# EAGLE design Cosmic Pi Main Board V2.4 OHWR (EAGLE 8.3.1)
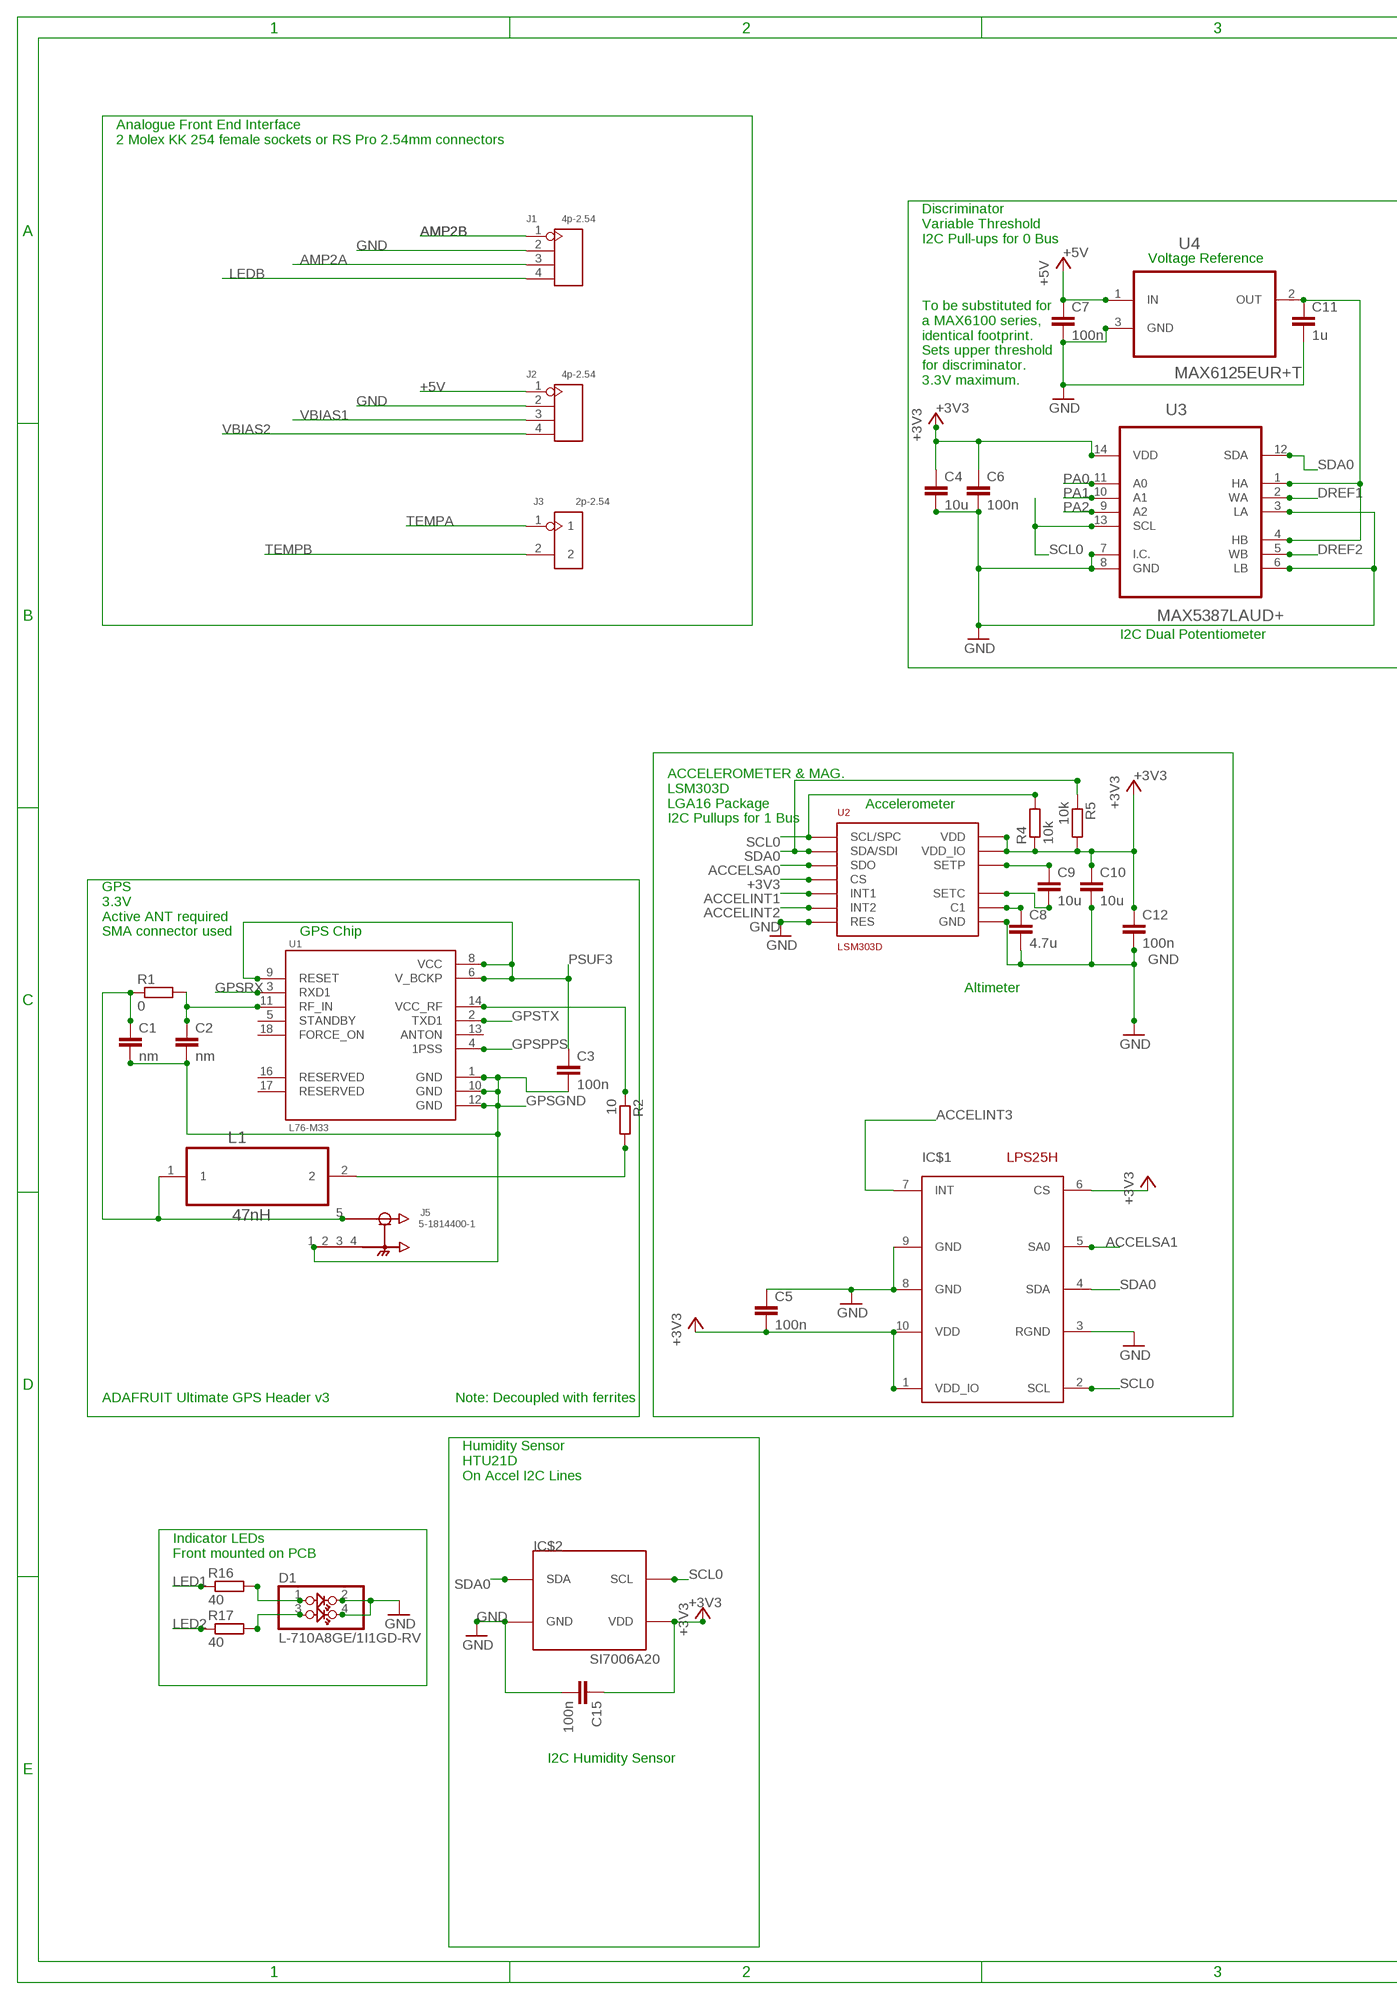
[diagram p0: schematic, sheet 1, part 1 of 2]
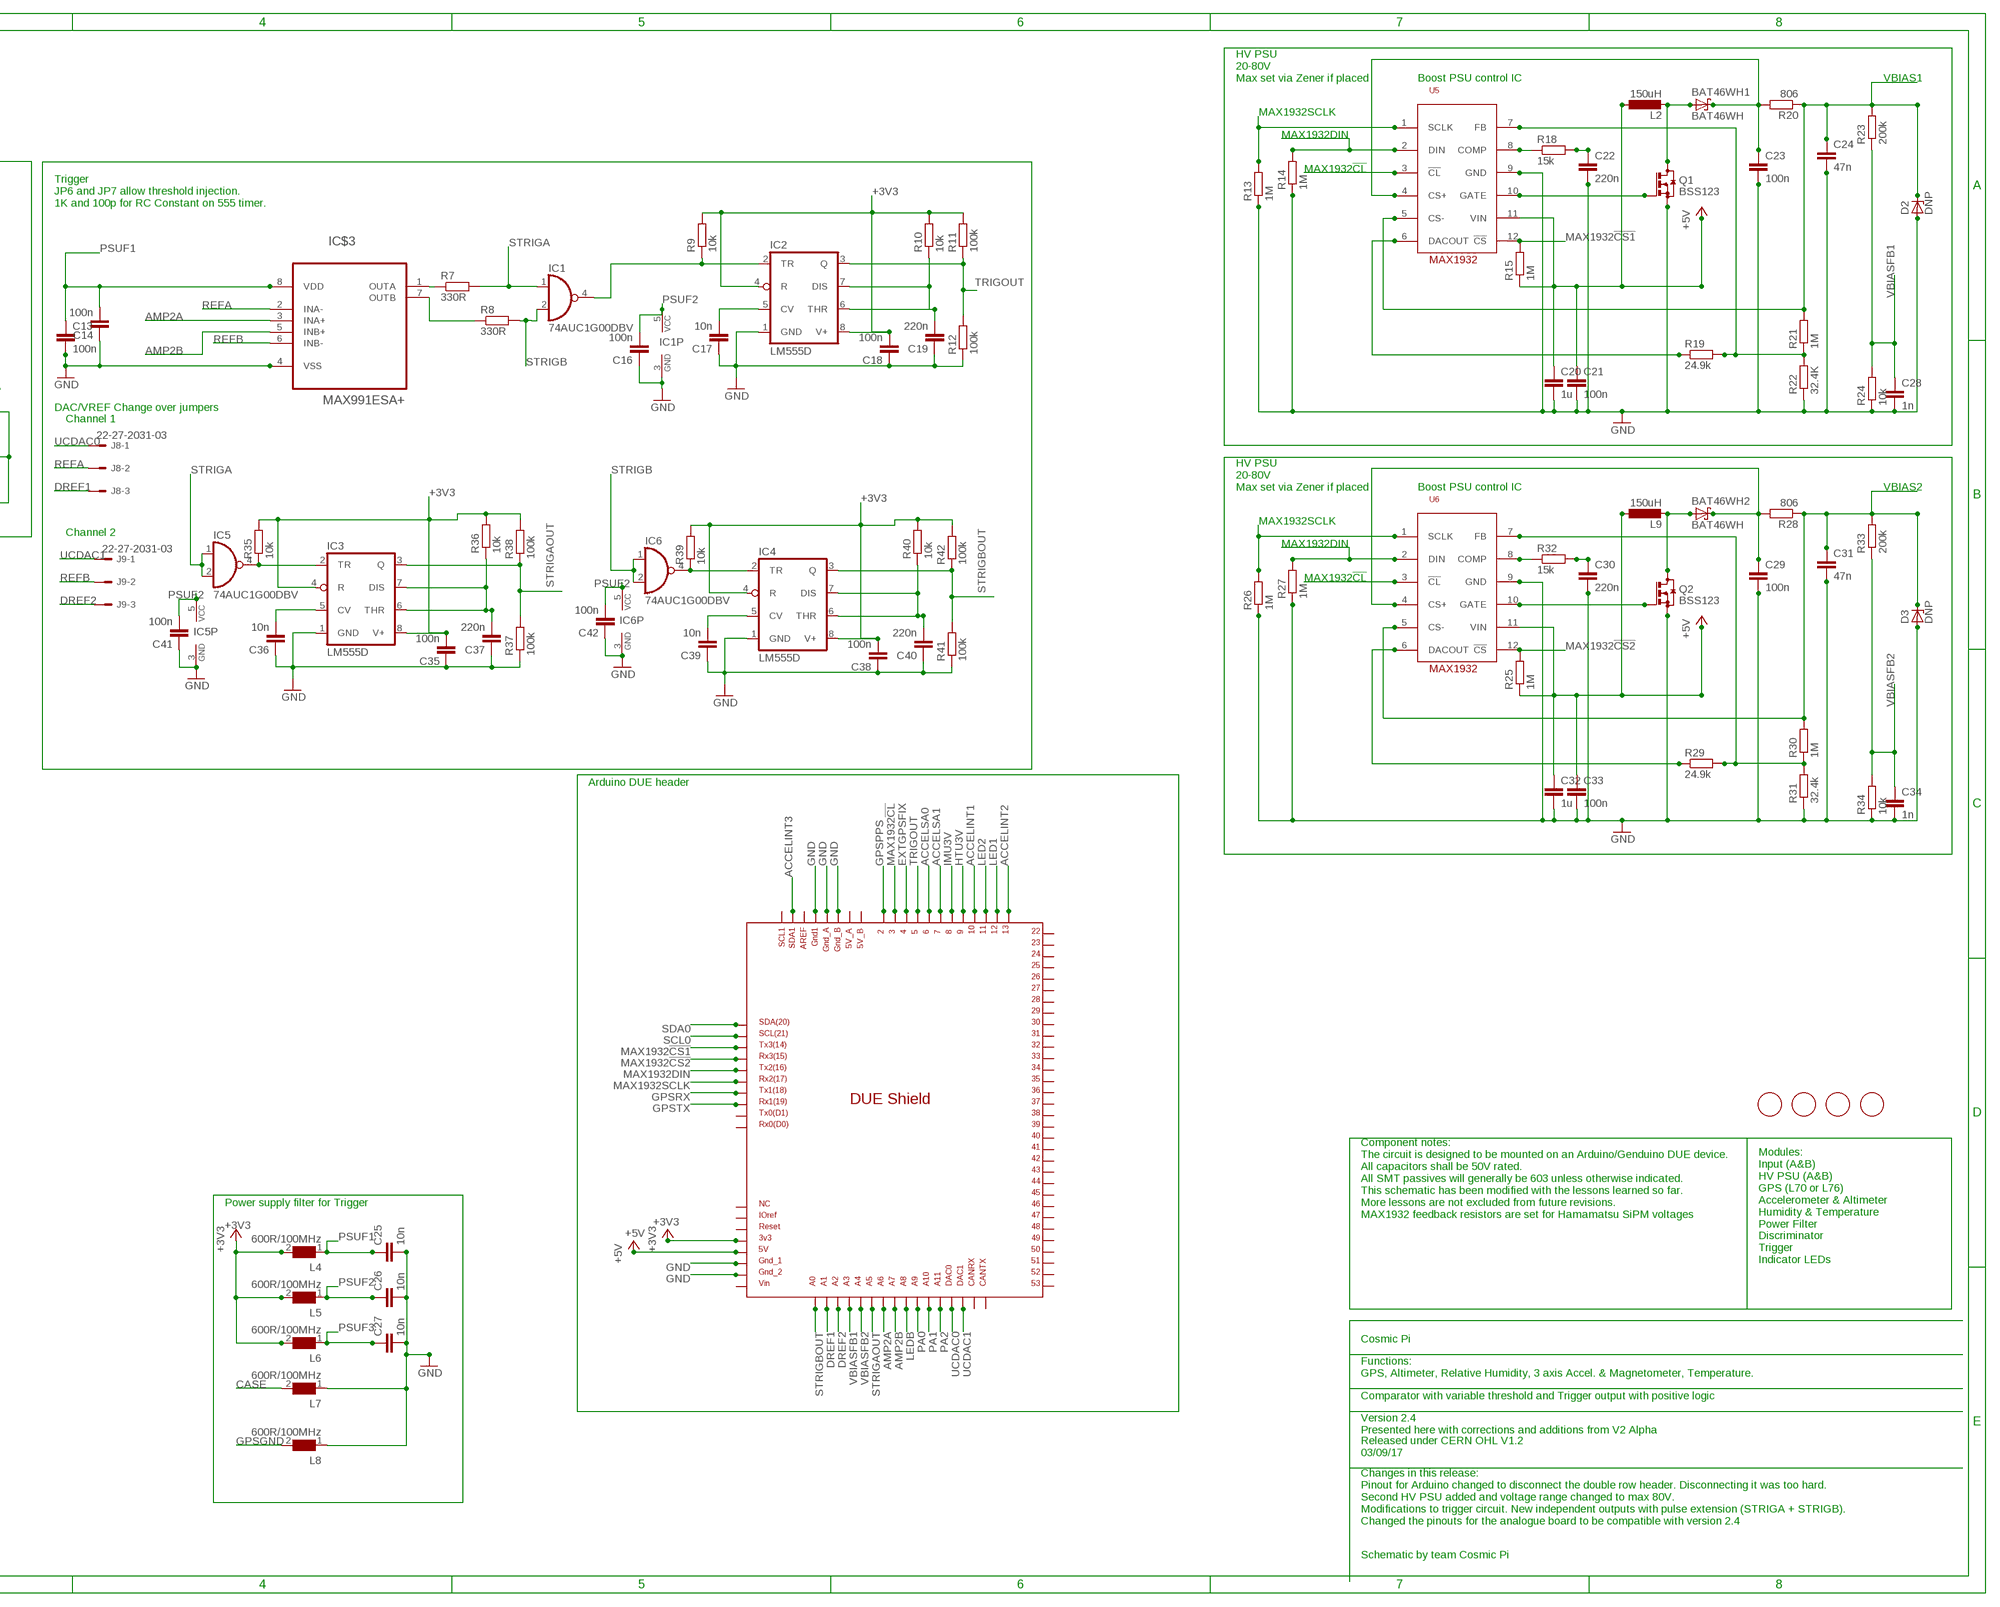
[diagram p1: schematic, sheet 1, part 2 of 2]

## Parts
BAT46WH1  BAT46WH  [SOD123F]
BAT46WH2  BAT46WH  [SOD123F]
C1  nm  C-EUC0603  [C0603]
C2  nm  C-EUC0603  [C0603]
C3  100n  C-EUC0603  [C0603]
C4  10u  C-EUC0603  [C0603]
C5  100n  C-EUC0603  [C0603]
C6  100n  C-EUC0603  [C0603]
C7  100n  C-EUC0603  [C0603]
C8  4.7u  C-EUC0603  [C0603]
C9  10u  C-EUC0603  [C0603]
C10  10u  C-EUC0603  [C0603]
C11  1u  C-EUC0603  [C0603]
C12  100n  C-EUC0603  [C0603]
C13  100n  C-EUC0603  [C0603]
C14  100n  C-EUC0603  [C0603]
C15  100n  C-EUC0603  [C0603]
C16  100n  C-EUC0603  [C0603]
C17  10n  C-EUC0603  [C0603]
C18  100n  C-EUC0603  [C0603]
C19  220n  C-EUC0603  [C0603]
C20  1u  C-EUC0603  [C0603]
C21  100n  C-EUC0603  [C0603]
C22  220n  C-EUC0603  [C0603]
C23  100n  C-EUC0603  [C0603]
C24  47n  C-EUC0603  [C0603]
C25  10n  C-EUC0603  [C0603]
C26  10n  C-EUC0603  [C0603]
C27  10n  C-EUC0603  [C0603]
C28  1n  C-EUC0603  [C0603]
C29  100n  C-EUC0603  [C0603]
C30  220n  C-EUC0603  [C0603]
C31  47n  C-EUC0603  [C0603]
C32  1u  C-EUC0603  [C0603]
C33  100n  C-EUC0603  [C0603]
C34  1n  C-EUC0603  [C0603]
C35  100n  C-EUC0603  [C0603]
C36  10n  C-EUC0603  [C0603]
C37  220n  C-EUC0603  [C0603]
C38  100n  C-EUC0603  [C0603]
C39  10n  C-EUC0603  [C0603]
C40  220n  C-EUC0603  [C0603]
C41  100n  C-EUC0603  [C0603]
C42  100n  C-EUC0603  [C0603]
D1  L-710A8GE/1I1GD-RV  KINGBRITET1  [2X02]
D2  DNP  ZENER-DIODESOT23  [SOT23]
D3  DNP  ZENER-DIODESOT23  [SOT23]
DUE1  DUE(NORMAL)  [DUE(NORMAL)]
IC1  74AUC1G00DBV  [SOT23-5]
IC2  LM555D  [SO08]
IC3  LM555D  [SO08]
IC4  LM555D  [SO08]
IC5  74AUC1G00DBV  [SOT23-5]
IC6  74AUC1G00DBV  [SOT23-5]
IC$1  LPS25H  [LPS25H]
IC$2  SI7006A20  [3X3DFN]
IC$3  MAX991ESA+  [SOIC-8]
J1  4p-2.54  DIP-BLACK-FEMALE-HEADER-VERT(4P-2.54)  [H4-2.54]
J2  4p-2.54  DIP-BLACK-FEMALE-HEADER-VERT(4P-2.54)  [H4-2.54]
J3  2p-2.54  DIP-BLACK-MALE-HEADER-VERT(2P-2.54)  [H2-2.54]
J5  5-1814400-1  [TE_5-1814400-1]
J8  22-27-2031-03  [6410-03]
J9  22-27-2031-03  [6410-03]
L1  47nH  B82496C3470J  [INDC1608X90N]
L2  150uH  L-EUL1812  [L1812]
L4  600R/100MHz  WE-CBF-74279218_1206  [1206]
L5  600R/100MHz  WE-CBF-74279218_1206  [1206]
L6  600R/100MHz  WE-CBF-74279218_1206  [1206]
L7  600R/100MHz  WE-CBF-74279218_1206  [1206]
L8  600R/100MHz  WE-CBF-74279218_1206  [1206]
L9  150uH  L-EUL1812  [L1812]
Q1  BSS123  [SOT23]
Q2  BSS123  [SOT23]
R1  0  R-EU_R0603  [R0603]
R2  10  R-EU_R0603  [R0603]
R4  10k  R-EU_R0603  [R0603]
R5  10k  R-EU_R0603  [R0603]
R7  330R  R-EU_R0603  [R0603]
R8  330R  R-EU_R0603  [R0603]
R9  10k  R-EU_R0603  [R0603]
R10  10k  R-EU_R0603  [R0603]
R11  100k  R-EU_R0603  [R0603]
R12  100k  R-EU_R0603  [R0603]
R13  1M  R-EU_R0603  [R0603]
R14  1M  R-EU_R0603  [R0603]
R15  1M  R-EU_R0603  [R0603]
R16  40  R-EU_R0603  [R0603]
R17  40  R-EU_R0603  [R0603]
R18  15k  R-EU_R0603  [R0603]
R19  24.9k  R-EU_R0603  [R0603]
R20  806  R-EU_R0603  [R0603]
R21  1M  R-EU_R0603  [R0603]
R22  32.4K  R-EU_R0603  [R0603]
R23  200k  R-EU_R0603  [R0603]
R24  10k  R-EU_R0603  [R0603]
R25  1M  R-EU_R0603  [R0603]
R26  1M  R-EU_R0603  [R0603]
R27  1M  R-EU_R0603  [R0603]
R28  806  R-EU_R0603  [R0603]
R29  24.9k  R-EU_R0603  [R0603]
R30  1M  R-EU_R0603  [R0603]
R31  32.4k  R-EU_R0603  [R0603]
R32  15k  R-EU_R0603  [R0603]
R33  200k  R-EU_R0603  [R0603]
R34  10k  R-EU_R0603  [R0603]
R35  10k  R-EU_R0603  [R0603]
R36  10k  R-EU_R0603  [R0603]
R37  100k  R-EU_R0603  [R0603]
R38  100k  R-EU_R0603  [R0603]
R39  10k  R-EU_R0603  [R0603]
R40  10k  R-EU_R0603  [R0603]
R41  100k  R-EU_R0603  [R0603]
R42  100k  R-EU_R0603  [R0603]
U1  L76-M33  [CAPCAV110P970X1010X250-18N]
U2  LSM303D  [LGA16L]
U3  MAX5387LAUD+  [TSSOP-14]
U4  MAX6125EUR+T  [SOT95P237X112-3N]
U5  MAX1932  [TQFN-12]
U6  MAX1932  [TQFN-12]
U$1  FIDUCIAL  [FIDUCIAL_1MM]
U$2  FIDUCIAL  [FIDUCIAL_1MM]
U$3  FIDUCIAL  [FIDUCIAL_1MM]
U$4  FIDUCIAL  [FIDUCIAL_1MM]

## Nets
+3V3 [Peripheral]: C4.1 C5.2 C6.1 C10.1 C12.1 C15.1 C18.2 C35.2 C38.2 DUE1.3V3 IC2.4(R) IC2.8(V+) IC3.4(R) IC3.8(V+) IC4.4(R) IC4.8(V+) IC$1.1(VDD_IO) IC$1.6(CS) IC$1.10(VDD) IC$2.P$5(VDD) L4.2 L5.2 L6.2 R4.1 R5.2 R9.2 R10.2 R11.2 R35.2 R36.2 R38.2 R39.2 R40.2 R42.2 U2.P$1(VDD_IO) U2.P$8(CS) U2.P$14(VDD) U3.14(VDD)
+5V [PSU]: C7.1 C20.1 C21.1 C32.1 C33.1 DUE1.5V J2.1 L2.1 L9.1 R15.1 R25.1 U4.1(IN) U5.11(VIN) U6.11(VIN)
ACCELINT1 [Peripheral]: DUE1.10 U2.P$11(INT1)
ACCELINT2 [Peripheral]: DUE1.13 U2.P$9(INT2)
ACCELINT3 [Peripheral]: DUE1.SDA1 IC$1.7(INT)
ACCELSA0 [Peripheral]: DUE1.6 U2.P$7(SDO)
ACCELSA1 [Peripheral]: DUE1.7 IC$1.5(SA0)
AMP2A [timing]: DUE1.A6 IC$3.3(INA+) J1.3
AMP2B [timing]: DUE1.A7 IC$3.5(INB+) J1.1
CASE [gnd]: L7.2
DREF1 [Peripheral]: DUE1.A1 J8.3 U3.2(WA)
DREF2 [Peripheral]: DUE1.A2 J9.3 U3.5(WB)
EXTGPSFIX [Peripheral]: DUE1.4
GND: C4.2 C5.1 C6.2 C7.2 C8.2 C10.2 C11.2 C12.2 C13.2 C14.1 C15.2 C16.1 C17.1 C18.1 C19.1 C20.2 C21.2 C22.2 C23.2 C24.2 C25.2 C26.2 C27.2 C28.2 C29.2 C30.2 C31.2 C32.2 C33.2 C34.2 C35.1 C36.1 C37.1 C38.1 C39.1 C40.1 C41.1 C42.1 D1.2 D1.4 D2.1(A) D3.1(A) DUE1.GND1 DUE1.GND_1 DUE1.GND_2 DUE1.GND_A DUE1.GND_B IC1.3(GND) IC2.1(GND) IC3.1(GND) IC4.1(GND) IC5.3(GND) IC6.3(GND) IC$1.3(RGND) IC$1.8(GND) IC$1.9(GND) IC$2.P$2(GND) IC$3.4(VSS) J1.2 J2.2 L7.1 L8.1 Q1.2(S) Q2.2(S) R12.1 R13.1 R14.1 R22.1 R24.1 R26.1 R27.1 R31.1 R34.1 R37.1 R41.1 U2.P$5(GND) U2.P$10(RES) U2.P$12(GND) U2.P$13(GND) U2.P$16(GND) U3.3(LA) U3.6(LB) U3.7(I.C.) U3.8(GND) U4.3(GND) U5.9(GND) U6.9(GND)
GPSGND [timing]: C1.2 C2.2 C3.2 J5.1(GND) L8.2 U1.1(GND) U1.10(GND) U1.12(GND)
GPSPPS [timing]: DUE1.2 U1.4(1PSS)
GPSRX [Comms]: DUE1.TX1 U1.3(RXD1)
GPSTX [Comms]: DUE1.RX1 U1.2(TXD1)
HTU3V [Peripheral]: DUE1.9
IMU3V [Peripheral]: DUE1.8
LED1: DUE1.12 R16.1
LED2: DUE1.11 R17.1
LEDB: DUE1.A8 J1.4
MAX1932!CL: DUE1.3 U5.3(!CL) U6.3(!CL)
MAX1932!CS1: DUE1.TX3 R15.2 U5.12(!CS)
MAX1932!CS2: DUE1.RX3 R25.2 U6.12(!CS)
MAX1932DIN: DUE1.TX2 R14.2 R27.2 U5.2(DIN) U6.2(DIN)
MAX1932SCLK: DUE1.RX2 R13.2 R26.2 U5.1(SCLK) U6.1(SCLK)
N$2: IC$3.1(OUTA) R7.1
N$4: IC$3.7(OUTB) R8.1
N$5 [Peripheral]: C17.2 IC2.5(CV)
N$6 [Peripheral]: C19.2 IC2.6(THR) IC2.7(DIS) R10.1
N$7 [Peripheral]: C36.2 IC3.5(CV)
N$8: Q2.1(G) U6.10(GATE)
N$9 [Vbias]: BAT46WH2.2(A) L9.2 Q2.3(D)
N$10 [Vbias]: BAT46WH2.1(K) C29.1 R28.2 U6.4(CS+)
N$11: R29.1 U6.6(DACOUT)
N$12: R32.1 U6.8(COMP)
N$13: C30.1 R32.2
N$14: R29.2 R30.1 R31.2 U6.7(FB)
N$17 [Peripheral]: C37.2 IC3.6(THR) IC3.7(DIS) R36.1
N$18: IC1.4(O) IC2.2(TR) R9.1
N$19: Q1.1(G) U5.10(GATE)
N$21 [Peripheral]: C39.2 IC4.5(CV)
N$22 [Peripheral]: C40.2 IC4.6(THR) IC4.7(DIS) R40.1
N$24: IC4.2(TR) IC6.4(O) R39.1
N$25: IC3.2(TR) IC5.4(O) R35.1
N$30 [Peripheral]: C11.1 U3.1(HA) U3.4(HB) U4.2(OUT)
N$31 [Vbias]: BAT46WH1.2(A) L2.2 Q1.3(D)
N$32 [Vbias]: BAT46WH1.1(K) C23.1 R20.2 U5.4(CS+)
N$47: R19.2 R21.1 R22.2 U5.7(FB)
N$53 [ant]: C1.1 J5.5(SIG) L1.1 R1.1
N$54: R19.1 U5.6(DACOUT)
N$55: R18.1 U5.8(COMP)
N$56: C22.1 R18.2
N$63 [Peripheral]: C9.1 U2.P$3(SETP)
N$64 [Peripheral]: C9.2 U2.P$2(SETC)
N$65 [Peripheral]: C8.1 U2.P$15(C1)
N$66 [Peripheral]: L1.2 R2.2
N$67 [Peripheral]: R2.1 U1.14(VCC_RF)
N$68 [ant]: C2.1 R1.2 U1.11(RF_IN)
N$72: D1.1 R16.2
N$73: D1.3 R17.2
PA0 [Peripheral]: DUE1.A9 U3.11(A0)
PA1 [Peripheral]: DUE1.A10 U3.10(A1)
PA2 [Peripheral]: DUE1.A11 U3.9(A2)
PSUF1 [PSU]: C13.1 C14.2 C25.1 IC$3.8(VDD) L4.1
PSUF2 [PSU]: C16.2 C26.1 C41.2 C42.2 IC1.5(VCC) IC5.5(VCC) IC6.5(VCC) L5.1
PSUF3 [timing]: C3.1 C27.1 L6.1 U1.6(V_BCKP) U1.8(VCC) U1.9(RESET)
REFA: IC$3.2(INA-) J8.2
REFB: IC$3.6(INB-) J9.2
SCL0 [Comms]: DUE1.SCL IC$1.2(SCL) IC$2.P$6(SCL) R4.2 U2.P$4(SCL/SPC) U3.13(SCL)
SDA0 [Comms]: DUE1.SDA IC$1.4(SDA) IC$2.P$1(SDA) R5.1 U2.P$6(SDA/SDI) U3.12(SDA)
STRIGA [timing]: IC1.1(I0) IC5.1(I0) IC5.2(I1) R7.2
STRIGAOUT [timing]: DUE1.A5 IC3.3(Q) R37.2 R38.1
STRIGB [timing]: IC1.2(I1) IC6.1(I0) IC6.2(I1) R8.2
STRIGBOUT [timing]: DUE1.A0 IC4.3(Q) R41.2 R42.1
TEMPA: J3.1
TEMPB: J3.2
TRIGOUT [timing]: DUE1.5 IC2.3(Q) R11.1 R12.2
UCDAC0: DUE1.DAC0 J8.1
UCDAC1: DUE1.DAC1 J9.1
VBIAS1 [Vbias]: C24.1 D2.3(C) J2.3 R20.1 R21.2 R23.2 U5.5(CS-)
VBIAS2 [Vbias]: C31.1 D3.3(C) J2.4 R28.1 R30.2 R33.2 U6.5(CS-)
VBIASFB1: C28.1 DUE1.A3 R23.1 R24.2
VBIASFB2: C34.1 DUE1.A4 R33.1 R34.2
Unconnected: DUE1.5V_A DUE1.5V_B DUE1.22 DUE1.23 DUE1.24 DUE1.25 DUE1.26 DUE1.27 DUE1.28 DUE1.29 DUE1.30 DUE1.31 DUE1.32 DUE1.33 DUE1.34 DUE1.35 DUE1.36 DUE1.37 DUE1.38 DUE1.39 DUE1.40 DUE1.41 DUE1.42 DUE1.43 DUE1.44 DUE1.45 DUE1.46 DUE1.47 DUE1.48 DUE1.49 DUE1.50 DUE1.51 DUE1.52 DUE1.53 DUE1.AREF DUE1.CANRX DUE1.CANTX DUE1.IOREF DUE1.NC DUE1.RESET DUE1.RX0 DUE1.SCL1 DUE1.TX0 DUE1.VIN J5.2(GND) J5.3(GND) J5.4(GND) U1.5(STANDBY) U1.13(ANTON) U1.16(RESERVED) U1.17(RESERVED) U1.18(FORCE_ON)

## Notes on the sheet
- HV PSU
  20-80V
  Max set via Zener if placed
- Boost PSU control IC
- Analogue Front End Interface
  2 Molex KK 254 female sockets or RS Pro 2.54mm connectors
- Discriminator 
  Variable Threshold
  I2C Pull-ups for 0 Bus
- Trigger
  JP6 and JP7 allow threshold injection.
  1K and 100p for RC Constant on 555 timer.
- Voltage Reference
- To be substituted for
  a MAX6100 series,
  identical footprint.
  Sets upper threshold
  for discriminator.
  3.3V maximum.
- DAC/VREF Change over jumpers
- Channel 1
- HV PSU
  20-80V
  Max set via Zener if placed
- Boost PSU control IC
- I2C Dual Potentiometer
- Channel 2
- Accelerometer
- ACCELEROMETER & MAG.
  LSM303D
  LGA16 Package
  I2C Pullups for 1 Bus
- GPS
  3.3V
  Active ANT required
  SMA connector used
- GPS Chip
- Arduino DUE header
- Altimeter
- ADAFRUIT Ultimate GPS Header v3 | Note: Decoupled with ferrites
- Humidity Sensor
  HTU21D
  On Accel I2C Lines
- Power supply filter for Trigger
- Component notes:
  The circuit is designed to be mounted on an Arduino/Genduino DUE device.
  All capacitors shall be 50V rated.
  All SMT passives will generally be 603 unless otherwise indicated.
  This schematic has been modified with the lessons learned so far.
  More lessons are not excluded from future revisions.
  MAX1932 feedback resistors are set for Hamamatsu SiPM voltages
- Indicator LEDs
  Front mounted on PCB
- Modules:
  Input (A&B)
  HV PSU (A&B)
  GPS (L70 or L76)
  Accelerometer & Altimeter
  Humidity & Temperature
  Power Filter
  Discriminator
  Trigger
  Indicator LEDs
- Cosmic Pi
- Functions:
  GPS, Altimeter, Relative Humidity, 3 axis Accel. & Magnetometer, Temperature.
- Comparator with variable threshold and Trigger output with positive logic
- I2C Humidity Sensor
- Version 2.4 
  Presented here with corrections and additions from V2 Alpha
- Released under CERN OHL V1.2
  03/09/17
- Changes in this release:
  Pinout for Arduino changed to disconnect the double row header. Disconnecting it was too hard.
  Second HV PSU added and voltage range changed to max 80V.
  Modifications to trigger circuit. New independent outputs with pulse extension (STRIGA + STRIGB).
  Changed the pinouts for the analogue board to be compatible with version 2.4
- Schematic by team Cosmic Pi

## Library data of the parts
BAT46WH1 BAT46WH2 = BAT46Wsymbol:BAT46W: Single Schottky barrier diode Single planar Schottky barrier diode with an integrated guard ring for stress protection, encapsulated in a Surface-Mounted Device (SMD) plastic package. AAL Eindhoven MK
C1-C21 C25-C27 C32 C33 C35-C42 = resistor:C-EU: CAPACITOR, European symbol
C22-C24 C28-C31 C34 = rcl:C-EU: CAPACITOR, European symbol
D1 = KingbriteBiLevel T1:KINGBRITET1: PIN HEADER
D2 D3 = diode:ZENER-DIODE: Z-Diode
DUE1 = DUElib130425:DUE(NORMAL)
IC1 IC5 IC6 = 74xx-little-de:74*1G00: 2-input NAND gate
IC2-IC4 = linear:*555: TIMER
IC$1 = LPS25H:LPS25H: ST-Micro Piezoresistive pressure sensor
IC$2 = SI7006:SI7006
IC$3 = MAX9916EKA_T:MAX991ESA+
J1 J2 = Seeed-Connector:DIP-BLACK-FEMALE-HEADER-VERT(4P-2.54): 320030017; MPN: F185-1104A1BSYA1
J3 = Seeed-Connector:DIP-BLACK-MALE-HEADER-VERT(2P-2.54): 320020016; MPN: P125-1102A0BS116A1
J5 = 5-1814400-1:5-1814400-1: Conn SMA RCP 0Hz to 3GHz 50Ohm Solder RA Thru-Hole Gold Over Nickel Over Copper
J8 J9 = con-molex:22-?-03: CONNECTOR wire to board 2.54 mm (.1 inch) pitch header; OC_FARNELL: unknown; OC_NEWARK: unknown
L1 = B82496C3470J:B82496C3470J: INDUCTOR, 47NH 270MA 5%
L2 L9 = rcl:L-EU: INDUCTOR, European symbol
L4-L8 = WE-CBF:WE-CBF: SMD EMI Suppression Ferrite Beads WE-CBF - Excellent anti-EMI properties - Low DC-restistance - Impedances till 3000 ohms - Rated current up to 6 A -- Reliable Ni-Sn electrodes -- Perfect as data lined filter and for uncoupling of distribution voltage; MPN: 74279218; OC_FARNELL: 1635758; OC_NEWARK: 08P2403; PACKAGE: IND-1206; SUPPLIER: Wuerth Elektronik
Q1 Q2 = transistor-small-signal:BSS123: N-CHANNEL MOS FET
R1 R2 R4 R5 R7-R42 = resistor:R-EU_: RESISTOR, European symbol
U1 = L76-M33:L76-M33: GPS Receiver 1575.42MHz 2.5V/3.3V 18-Pin
U2 = LSM303D:LSM303D
U3 = MAX5387LAUD_:MAX5387LAUD+: Digital Potentiometer
U4 = Maxim_By_element14_Batch_1:MAX6125EUR+T: Low-Cost, Low-Dropout 3-Terminal Voltage References; MPN: MAX6125EUR+T; OC_FARNELL: -; OC_NEWARK: 68K9447; PACKAGE: SOT-23-3; SUPPLIER: Maxim
U5 U6 = TQFN-12:MAX1932
U$1-U$4 = adafruit:FIDUCIAL: For use by pick and place machines to calibrate the vision/machine, 1mm By microbuilder.eu

## Net classes
0 default: width 0.152 mm, drill 0.406 mm, clearance 0.152 mm
1 Peripheral: width 0.152 mm, drill 0.406 mm, clearance 0.152 mm to class 0, clearance 0.152 mm
2 gnd: width 0.305 mm, drill 0.406 mm, clearance 0.205 mm to class 0, clearance 0.205 mm to class 1, clearance 0.254 mm
3 timing: width 0.152 mm, drill 0.406 mm, clearance 0.152 mm to class 0, clearance 0.152 mm to class 1, clearance 0.152 mm to class 2, clearance 0.152 mm
4 Comms: width 0.152 mm, drill 0.406 mm, clearance 0.152 mm to class 0, clearance 0.152 mm to class 1, clearance 0.152 mm to class 2, clearance 0.152 mm to class 3, clearance 0.152 mm
5 PSU: width 0.152 mm, drill 0.406 mm, clearance 0.152 mm to class 0, clearance 0.152 mm to class 1, clearance 0.152 mm to class 2, clearance 0.152 mm to class 3, clearance 0.152 mm to class 4, clearance 0.152 mm
6 Vbias: width 0.152 mm, drill 0.406 mm, clearance 0.254 mm to class 0, clearance 0.254 mm to class 1, clearance 0.254 mm to class 2, clearance 0.254 mm to class 3, clearance 0.254 mm to class 4, clearance 0.254 mm to class 5, clearance 0.356 mm
7 ant: width 0.61 mm, drill 0.406 mm, clearance 0.61 mm to class 0, clearance 0.61 mm to class 1, clearance 0.61 mm to class 2, clearance 0.61 mm to class 3, clearance 0.61 mm to class 4, clearance 0.61 mm to class 5, clearance 0.61 mm to class 6, clearance 0.61 mm

## Board
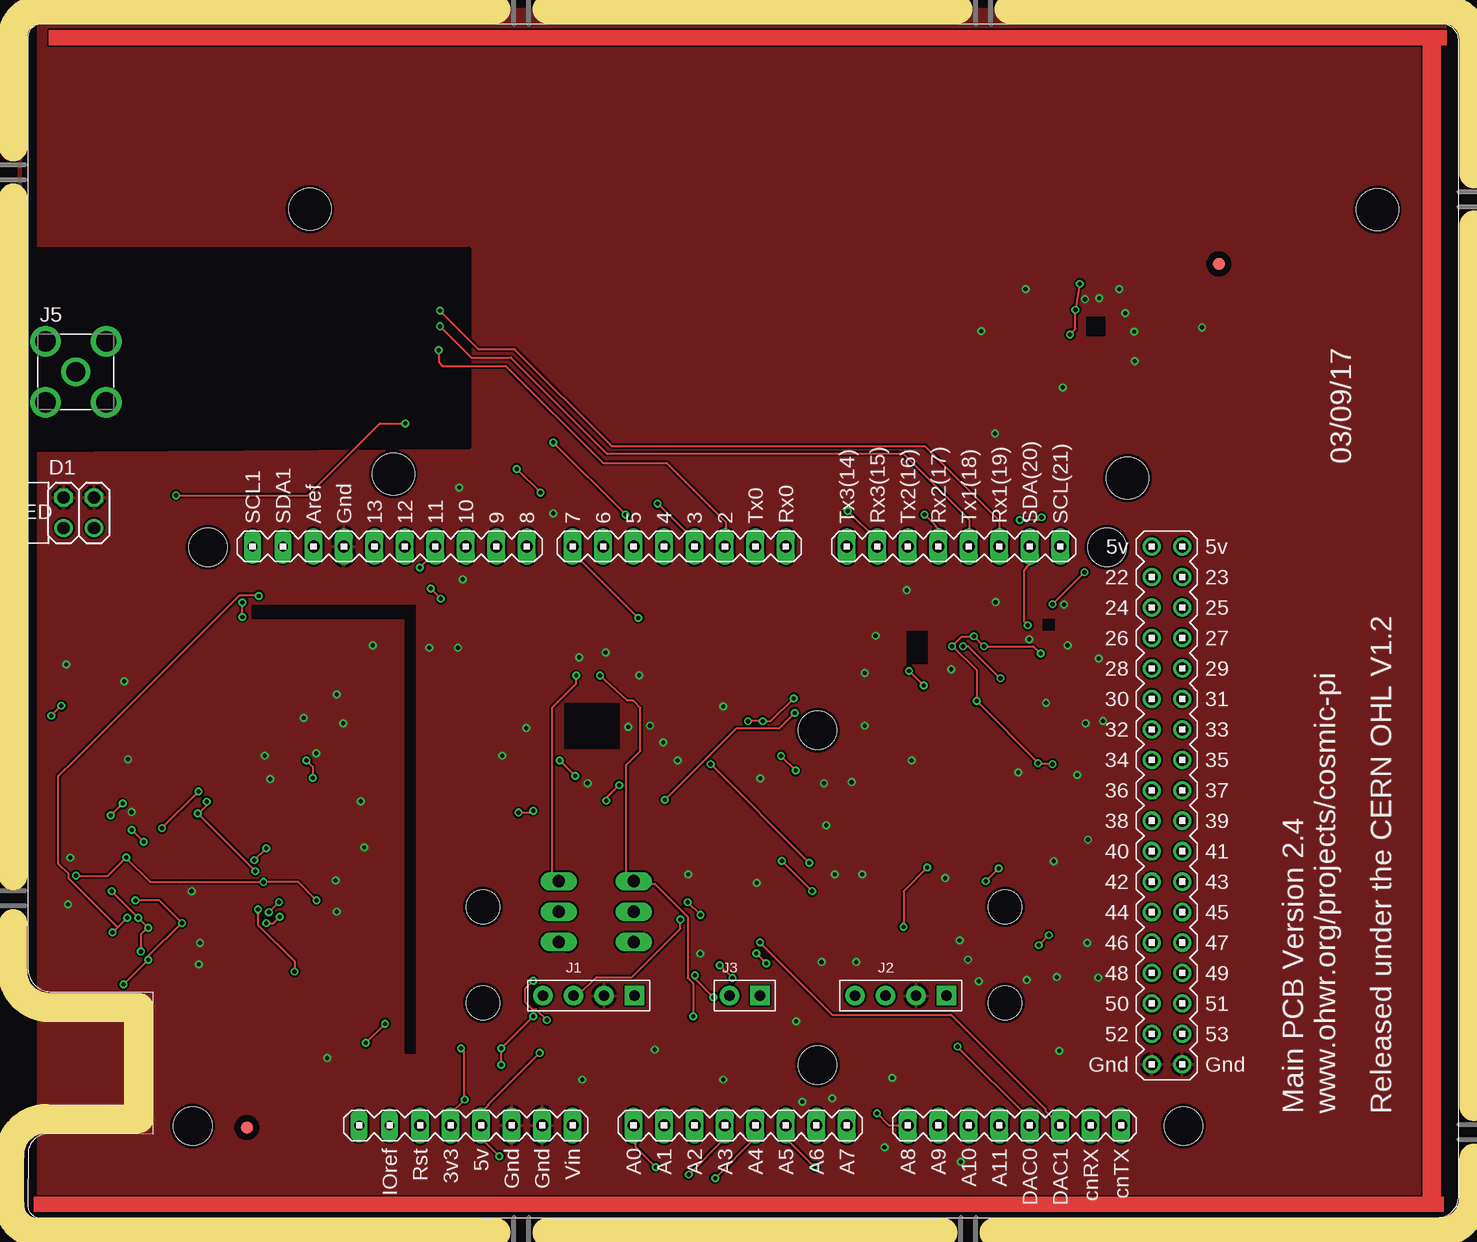
[diagram p2: board, top side]
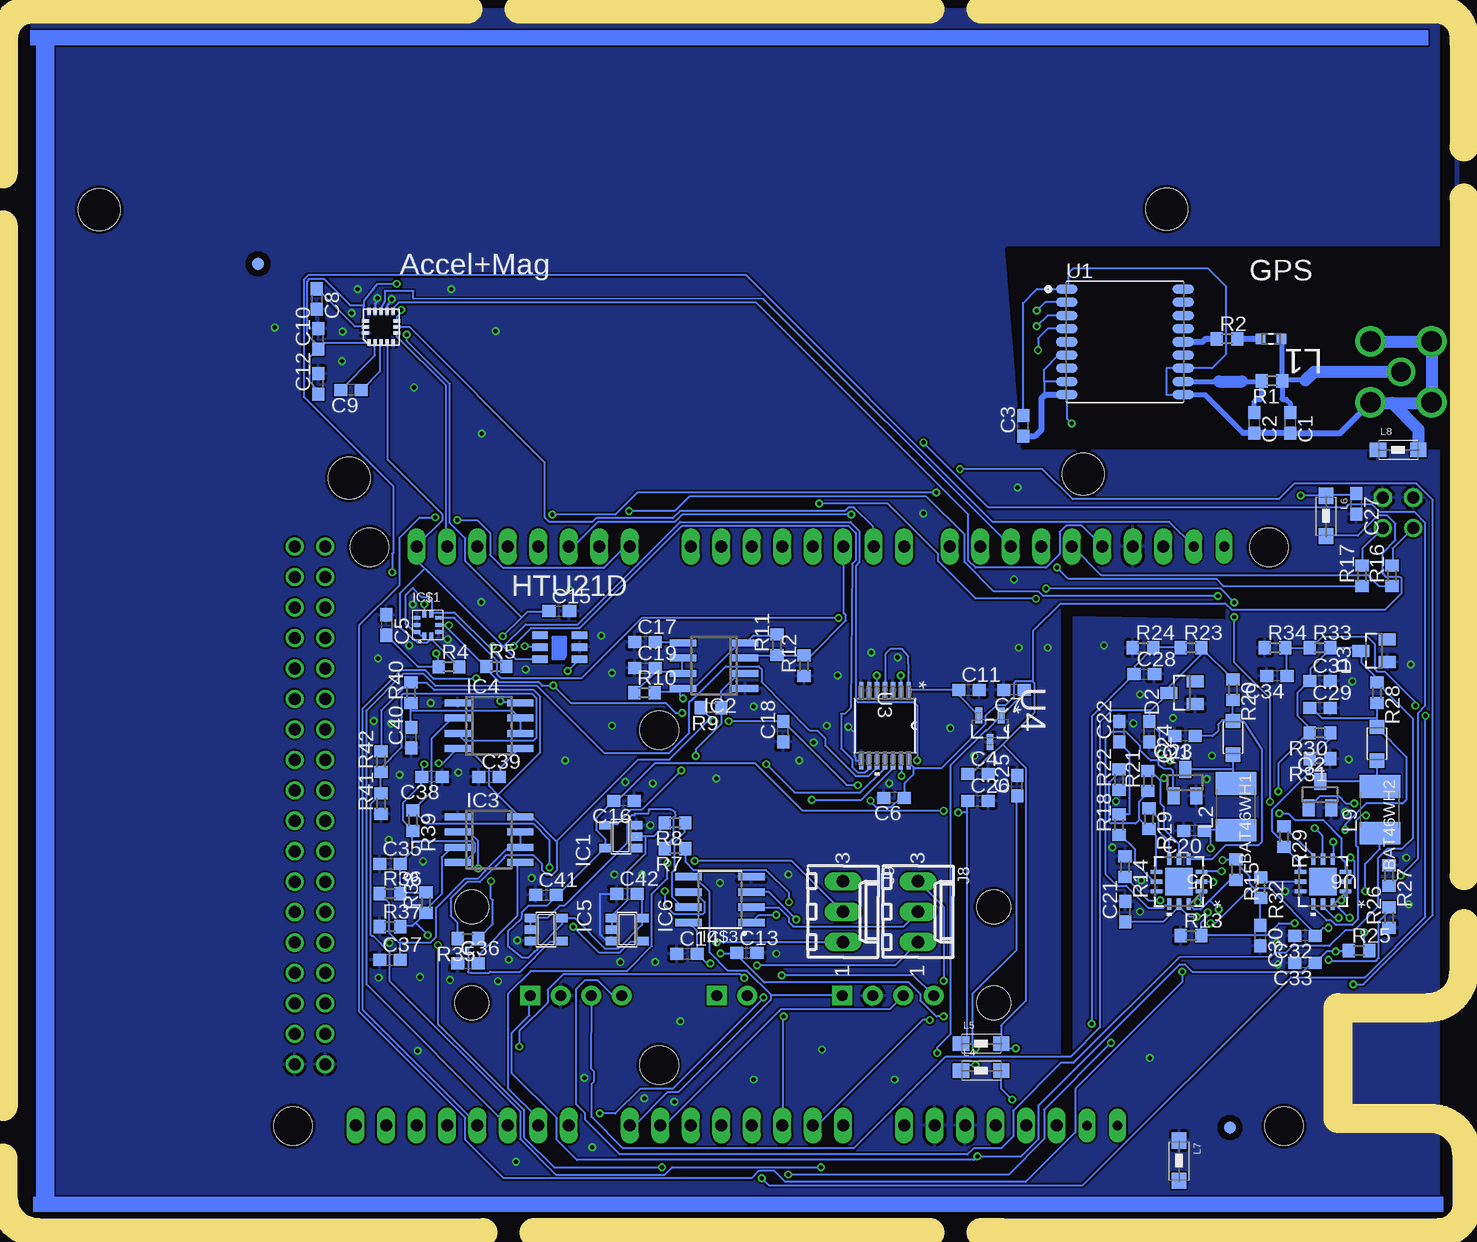
[diagram p3: board, bottom side, seen from below]

No outline drawn. Coordinates in mm, seen from the top.
Copper layers (1*16): Top 0.035mm / dielectric 1.5mm / Bottom 0.035mm
Design rules "SeeedStudio_2layer_DRU_no_angle_20140221": minimum track width 6mil, minimum drill 12mil, track to track 6mil, track to pad 6mil, pad to pad 6mil, via to via 6mil, smd to smd 0mil, copper to edge 10mil, drill to drill 10mil, minimum pad ring 10mil, minimum via ring 6mil, stop-mask expansion 2mil, vias tented up to drill 100mil, thermal gap 10mil
Holes 3.2 mm at 96.58,7.62 15.27,55.88 90.2,55.88 14,7.62 66.07,40.64 66.07,12.7
Holes 2.8 mm at 81.69,17.89 38.19,17.89 81.69,25.89 38.19,25.89
Holes 3.5 mm at 23.76,84.07 91.89,61.64 112.72,84.03 30.72,61.99
tRestrict: area 23.6,68.2 to 30.9,77.8; area 73.5,46.2 to 75.2,48.9; area 84.8,48.9 to 85.8,49.9; area 88.5,73.5 to 90,75.1; area 45,39.1 to 49.6,42.9; area 0,0 to 1,2; area -0.2,97 to 0.8,99.5; area 19,13.8 to 32.5,51; area -0.5,64 to 37,80.7; area -0.2,-0.3 to 1,99.5; area 118.5,0.3 to 120.2,100.8
bRestrict: area 88.5,73.5 to 90,75.1; area 84.8,48.9 to 85.8,49.9; area 73.5,46.2 to 75.2,48.9; area 23.6,68.2 to 30.9,77.8; area 45,39.1 to 49.6,42.9; area 19,13.8 to 32.5,51; area 0,0 to 1,2; area -0.2,97 to 0.8,99.5; area -0.5,64.2 to 37,80.7; area 118.5,0.3 to 120.2,100.8; area -0.2,-0.3 to 1,99.5
Milling: 24 lines

### Footprints (pad centres in the part's own frame; a part is rotated, then mirrored left to right if it is on the bottom)
SOD123F = smd 1.2 x 1.2: 1 -1.4,0; 2 1.4,0
C0603 = smd 1.1 x 1: 1 -0.85,0; 2 0.85,0
2X02 = drill 1.016: 1 -1.27,-1.27; 3 1.27,-1.27 | drill 1.016 octagon: 2 -1.27,1.27; 4 1.27,1.27
SOT23 = smd 1 x 1.4: 1 -0.95,-1.1; 2 0.95,-1.1; 3 0,1.1
DUE(NORMAL) = drill 1 long: 2 -16.51,30.48; 3 -19.05,30.48; 3V3 -39.37,-17.78; 4 -21.59,30.48; 5 -24.13,30.48; 5V -36.83,-17.78; 6 -26.67,30.48; 7 -29.21,30.48; 8 -33.02,30.48; 9 -35.56,30.48; 10 -38.1,30.48; 11 -40.64,30.48; 12 -43.18,30.48; 13 -45.72,30.48; A0 -24.13,-17.78; A1 -21.59,-17.78; A2 -19.05,-17.78; A3 -16.51,-17.78; A4 -13.97,-17.78; A5 -11.43,-17.78; A6 -8.89,-17.78; A7 -6.35,-17.78; A8 -1.27,-17.78; A9 1.27,-17.78; A10 3.81,-17.78; A11 6.35,-17.78; AREF -50.8,30.48; AREF1 -50.8,30.48; CANRX 13.97,-17.78; CANTX 16.51,-17.78; DAC0 8.89,-17.78; DAC1 11.43,-17.78; GND1 -48.26,30.48; GND_1 -34.29,-17.78; GND_2 -31.75,-17.78; RESET -41.91,-17.78; RX0 -11.43,30.48; RX1 6.35,30.48; RX2 1.27,30.48; RX3 -3.81,30.48; SCL 11.43,30.48; SDA 8.89,30.48; TX0 -13.97,30.48; TX1 3.81,30.48; TX2 -1.27,30.48; TX3 -6.35,30.48; VIN -29.21,-17.78 | drill 1: 5V_A 19.05,30.48; 5V_B 21.59,30.48; 22 19.05,27.94; 23 21.59,27.94; 24 19.05,25.4; 25 21.59,25.4; 26 19.05,22.86; 27 21.59,22.86; 28 19.05,20.32; 29 21.59,20.32; 30 19.05,17.78; 31 21.59,17.78; 32 19.05,15.24; 33 21.59,15.24; 34 19.05,12.7; 35 21.59,12.7; 36 19.05,10.16; 37 21.59,10.16; 38 19.05,7.62; 39 21.59,7.62; 40 19.05,5.08; 41 21.59,5.08; 42 19.05,2.54; 43 21.59,2.54; 44 19.05,0; 45 21.59,0; 46 19.05,-2.54; 47 21.59,-2.54; 48 19.05,-5.08; 49 21.59,-5.08; 50 19.05,-7.62; 51 21.59,-7.62; 52 19.05,-10.16; 53 21.59,-10.16; GND_A 19.05,-12.7; GND_B 21.59,-12.7 | drill 0.8 pad 1.422 long: IOREF -44.45,-17.78; NC -46.99,-17.78; SCL1 -55.88,30.48; SDA1 -53.34,30.48
SOT23-5 = smd 0.69 x 0.99: 1 -0.95,-1.29; 2 0,-1.29; 3 0.95,-1.29; 4 0.95,1.3; 5 -0.95,1.3
SO08 = smd 0.6 x 2.2: 1 -1.905,-2.6; 2 -0.635,-2.6; 3 0.635,-2.6; 4 1.905,-2.6; 5 1.905,2.6; 6 0.635,2.6; 7 -0.635,2.6; 8 -1.905,2.6
LPS25H = smd 0.32 x 0.55: 1 -0.3,-0.9; 2 0.3,-0.9; 6 0.3,0.9; 7 -0.3,0.9 | smd 0.55 x 0.32: 3 0.9,-0.6; 4 0.9,0; 5 0.9,0.6; 8 -0.9,0.6; 9 -0.9,0; 10 -0.9,-0.6
3X3DFN = smd 1.27 x 0.635: P$1 -0.2,0; P$2 -0.2,-1; P$3 -0.2,-2; P$4 3.1,-2; P$5 3.1,-1; P$6 3.1,0
SOIC-8 = smd 0.61 x 2.21: 1 -1.905,-2.616; 2 -0.635,-2.616; 3 0.635,-2.616; 4 1.905,-2.616; 5 1.905,2.616; 6 0.635,2.616; 7 -0.635,2.616; 8 -1.905,2.616
H4-2.54 = drill 0.889 pad 1.651 square: 1 0,3.81 | drill 0.889 pad 1.651: 2 0,1.27; 3 0,-1.27; 4 0,-3.81
H2-2.54 = drill 0.889 pad 1.651 square: 1 0,1.27 | drill 0.889 pad 1.651: 2 0,-1.27
TE_5-1814400-1 = drill 1.7 pad 2.3: 1 -2.54,2.54; 2 -2.54,-2.54; 3 2.54,-2.54; 4 2.54,2.54 | drill 1.6 pad 2.2: 5 0,0
6410-03 = drill 1.016 long: 1 2.54,0; 2 0,0; 3 -2.54,0
INDC1608X90N = smd 0.787 x 0.889: 1 -0.889,0; 2 0.889,0
L1812 = smd 1.9 x 3.4: 1 -1.95,0; 2 1.95,0
1206 = smd 1.35 x 1.2: 1 -1.675,0; 2 1.675,0
R0603 = smd 1 x 1.1: 1 -0.85,0; 2 0.85,0
CAPCAV110P970X1010X250-18N = smd 1.8 x 0.8: 1 -4.85,4.4; 2 -4.85,3.3; 3 -4.85,2.2; 4 -4.85,1.1; 5 -4.85,0; 6 -4.85,-1.1; 7 -4.85,-2.2; 8 -4.85,-3.3; 9 -4.85,-4.4; 10 4.85,-4.4; 11 4.85,-3.3; 12 4.85,-2.2; 13 4.85,-1.1; 14 4.85,0; 15 4.85,1.1; 16 4.85,2.2; 17 4.85,3.3; 18 4.85,4.4
LGA16L = smd 0.6 x 0.3: P$1 -1.3,1; P$2 -1.3,0.5; P$3 -1.3,0; P$4 -1.3,-0.5; P$5 -1.3,-1; P$9 1.3,-1; P$10 1.3,-0.5; P$11 1.3,0; P$12 1.3,0.5; P$13 1.3,1 | smd 0.3 x 0.6: P$6 -0.5,-1.3; P$7 0,-1.3; P$8 0.5,-1.3; P$14 0.5,1.3; P$15 0,1.3; P$16 -0.5,1.3
TSSOP-14 = smd 1.422 x 0.356: 1 -2.921,1.981; 2 -2.921,1.321; 3 -2.921,0.66; 4 -2.921,0; 5 -2.921,-0.66; 6 -2.921,-1.321; 7 -2.921,-1.981; 8 2.921,-1.981; 9 2.921,-1.321; 10 2.921,-0.66; 11 2.921,0; 12 2.921,0.66; 13 2.921,1.321; 14 2.921,1.981
SOT95P237X112-3N = smd 1.321 x 0.559: 1 -1.092,0.94; 2 -1.092,-0.94; 3 1.092,0
TQFN-12 = smd 0.965 x 0.356: 1 -1.867,0.813; 2 -1.867,0; 3 -1.867,-0.813; 7 1.867,-0.813; 8 1.867,0; 9 1.867,0.813 | smd 0.356 x 0.965: 4 -0.813,-1.867; 5 0,-1.867; 6 0.813,-1.867; 10 0.813,1.867; 11 0,1.867; 12 -0.813,1.867 | smd 2.261 x 2.261: 13 0,0
FIDUCIAL_1MM = smd 1 x 1: 1 0,0

### Placement (x,y rotation side)
BAT46WH1  18.25,40 270 bottom
BAT46WH2  6.25,39.5 270 bottom
C1  13.5,66.25 270 bottom
C2  16.5,66.25 270 bottom
C3  35.75,66 90 bottom
C4  39.5,37 0 bottom
C5  88.8,49.4 270 bottom
C6  46.5,35 180 bottom
C7  36.5,44 180 bottom
C8  94.62,76.57 270 bottom
C9  91.75,69 180 bottom
C10  94.5,73.25 90 bottom
C11  40.25,44 0 bottom
C12  94.5,69.5 90 bottom
C13  58.76,22.05 0 bottom
C14  63.75,22 0 bottom
C15  74.4,50.55 0 bottom
C16  69,34.75 180 bottom
C17  67.25,48 0 bottom
C18  55.75,40.5 90 bottom
C19  67.25,45.8 0 bottom
C20  21.5,32.25 180 bottom
C21  27.25,25.5 90 bottom
C22  27.75,40.5 90 bottom
C23  22.25,40.15 180 bottom
C24  25.25,40.5 270 bottom
C25  36.25,36 90 bottom
C26  39.5,34.75 0 bottom
C27  8,59.5 270 bottom
C28  25.65,45.3 0 bottom
C29  11,42.5 0 bottom
C30  16,23.5 270 bottom
C31  11,44.75 0 bottom
C32  12.25,23.5 180 bottom
C33  12.25,21.25 180 bottom
C34  14.6,45.15 180 bottom
C35  88.5,29.5 0 bottom
C36  82,21.2 0 bottom
C37  88.5,21.5 0 bottom
C38  85,36.75 180 bottom
C39  80.25,36.75 0 bottom
C40  86.75,40 90 bottom
C41  75.5,26.9 0 bottom
C42  68.75,27 0 bottom
D1  4.5,58.75 0 top
D2  22.5,43.75 90 bottom
D3  6.5,47.25 90 bottom
DUE1  74.86,25.46 0 top
IC1  69.25,31.75 90 bottom
IC2  61.5,46 90 bottom
IC3  80.25,31.5 270 bottom
IC4  80.25,41 270 bottom
IC5  75.5,24 270 bottom
IC6  68.75,24 270 bottom
IC$1  85.35,49.4 0 bottom
IC$2  72.9,46.55 180 bottom
IC$3  61,26.5 90 bottom
J1  47,18.5 270 top
J2  73,18.5 270 top
J3  60,18.5 270 top
J5  4.25,70.5 270 top
J8  44.5,25.5 270 bottom
J9  50.75,25.5 270 bottom
L1  15.08,73.25 180 bottom
L2  18,34.25 90 bottom
L4  39.25,12.25 0 bottom
L5  39.25,14.5 0 bottom
L6  10.5,58.5 270 bottom
L7  22.75,4.75 270 bottom
L8  4.5,64 0 bottom
L9  6,34 90 bottom
Q1  22.25,36.25 0 bottom
Q2  11,35.25 0 bottom
R1  15,69.75 180 bottom
R2  18.75,73.25 0 bottom
R4  83.6,45.9 0 bottom
R5  79.65,45.93 0 bottom
R7  64.75,30.75 180 bottom
R8  64.75,32.9 180 bottom
R9  61.75,42.5 180 bottom
R10  67.3,43.75 0 bottom
R11  56.25,47.75 90 bottom
R12  54,46 90 bottom
R13  21.75,23.5 0 bottom
R14  27.25,29.25 270 bottom
R15  18,29 270 bottom
R16  5,53.5 90 bottom
R17  7.5,53.5 90 bottom
R18  27.75,32.75 90 bottom
R19  25.25,33.25 270 bottom
R20  18.25,44 270 bottom
R21  25.35,36.4 90 bottom
R22  27.75,36.5 90 bottom
R23  21.75,47.5 0 bottom
R24  25.75,47.5 0 bottom
R25  7.75,22.25 0 bottom
R26  5.25,25 90 bottom
R27  5.25,28.5 270 bottom
R28  6.25,43.75 270 bottom
R29  14,31.75 270 bottom
R30  11,40.4 180 bottom
R31  11,38.25 180 bottom
R32  15.95,27.5 270 bottom
R33  11,47.5 0 bottom
R34  14.75,47.5 0 bottom
R35  82,23.25 180 bottom
R36  88.5,27 0 bottom
R37  88.5,24.25 0 bottom
R38  85.5,26.25 90 bottom
R39  86.6,33.1 270 bottom
R40  86.75,43.75 90 bottom
R41  89.25,34.5 90 bottom
R42  89.25,38 90 bottom
U1  27.25,73 0 bottom
U2  89.25,74.25 90 bottom
U3  47.25,41 270 bottom
U4  38.5,40.75 270 bottom
U5  22.75,28 180 bottom
U6  10.75,28 180 bottom
U$1  18.5,7.5 0 top
U$2  99.5,79.5 0 top
U$3  18.5,7.5 0 bottom
U$4  99.5,79.5 0 bottom

### Tracks (layer width: path | path; a pad name or v marks a point on that pad's centre or on a via)
+3V3  (via drill 0.35)
  Top 0.152: DUE1.3V3 35.51,7.7 35.51,8.69 v36.65,9.83 36.58,9.83 36.58,13.87 v36.35,14.1 | v87.92,77.84 v87.55,75.67 87.55,74.07 v87.1,73.61 | v84.66,47.02 84.05,47.62 v79.93,47.62 v79.1,48.46 79.1,48.39 78.03,48.39 v77.27,47.62 77.34,47.62 79.32,45.64 v79.32,43.05 84.51,37.87 | v60.27,41.38 v61.49,41.38 62.18,41.38 v64.08,43.28 | v85.65,37.8 85.57,37.87 84.51,37.87 | 84.51,37.87 v84.43,37.87 | v48.46,34.75 48.46,34.98 v49.53,36.04
  Bottom 0.152: v36.65,9.83 37.57,10.74 37.57,12.19 L4.2 | 37.45,39.43 34.82,42.06 34.82,44.58 34.94,44.69 | 37.45,39.43 38.18,38.71 38.33,38.71 40.01,37.03 40.31,37.03 C4.1 | 34.94,44.69 34.98,44.73 36.35,44.73 36.5,44.58 36.5,43.43 37.19,42.75 37.95,42.75 38.86,41.83 38.86,41.15 42.52,37.49 44.81,37.49 44.84,37.53 | 44.84,37.53 45.34,38.02 U3.14 | 44.84,37.53 44.88,37.49 44.88,36.96 45.64,36.2 45.64,35.05 C6.1 45.72,34.98 45.95,34.98 46.71,34.21 48.01,34.21 48.46,34.67 v48.46,34.75 | 37.45,39.43 35.51,37.49 35.51,18.06 37.57,16 37.57,14.55 L5.2 37.49,14.55 37.03,14.1 v36.35,14.1 | L6.2 10.44,56.84 7.85,56.84 6.17,58.52 5.41,58.52 4.72,57.84 4.72,56.46 5.79,55.4 5.79,53.72 5.49,53.42 4.34,53.42 4.19,53.26 4.19,52.05 5.56,50.67 18.36,50.67 18.9,51.21 32.61,51.21 34.9,48.92 34.9,44.73 34.94,44.69 | v87.55,75.67 87.55,75.44 87.94,75.06 87.94,74.75 U2.P$8 | v87.92,77.84 89.51,77.84 90.6,76.5 90.64,76.46 90.64,76.01 | 90.64,76.01 90.68,75.97 90.68,74.83 90.6,74.75 U2.P$14 | U2.P$1 90.3,72.92 94.03,72.92 94.49,72.47 C10.1 | C12.1 94.56,68.66 94.56,69.04 95.25,69.72 95.25,71.7 94.56,72.39 C10.1 | 90.64,76.01 90.68,76.05 91.82,76.05 94.03,78.26 95.17,78.26 95.4,78.03 95.4,73.61 94.41,72.62 C10.1 | C5.2 88.77,48.54 86.18,45.95 84.51,45.95 R4.1 84.51,46.02 84.51,46.86 v84.66,47.02 | IC$1.1 85.72,48.54 85.95,48.54 86.18,48.77 IC$1.10 86.26,48.84 86.49,48.84 87.19,49.45 87.19,51.91 86.6,52.5 85.88,51.74 85.42,51.74 85.04,51.36 85.04,50.44 | 85.04,50.44 85.04,50.37 IC$1.6 85.04,50.44 | 80.12,47.43 83.13,50.44 85.04,50.44 | 80.12,47.43 78.87,46.18 78.87,45.95 R5.2
  Bottom 0.152: v79.1,48.46 77.53,50.02 | 77.53,50.02 77.04,50.52 75.29,50.52 C15.1 | 80.12,47.43 v79.93,47.62 | v77.27,47.62 76.05,47.62 IC$2.P$5 | v79.32,43.05 79.25,42.98 77.72,42.98 IC4.8 | v87.1,73.61 87.1,73.08 83.52,69.49 83.52,57.91 82.22,56.62 82.22,54.71 77.53,50.02 | R10.2 66.37,43.81 64.39,43.81 64.16,44.04 IC2.8 | R11.2 56.31,48.54 58.22,48.54 58.83,47.93 IC2.4 58.9,47.85 59.44,47.85 63.17,44.12 64.08,44.12 IC2.8 | R38.2 85.57,27.05 87.63,27.05 R36.2 87.63,27.13 87.63,29.49 C35.2 87.63,29.57 86.64,30.56 86.64,31.39 | 86.64,31.39 86.64,32.23 R39.2 86.64,32.31 87.4,33.07 87.4,34.59 85.88,36.12 85.88,36.73 C38.2 85.8,36.8 85.8,37.64 v85.65,37.8 | 86.64,31.39 81.61,31.39 81.46,31.24 81.46,30.48 82.3,29.64 82.83,29.64 IC3.4 | R42.2 89.23,38.86 89.23,42.29 86.94,44.58 86.79,44.58 R40.2 86.72,44.58 85.42,44.58 84.81,43.97 76.5,43.97 75.97,43.43 75.97,38.79 79.52,35.24 | v60.27,41.38 55.78,41.38 C18.2 55.7,41.3 50.44,36.04 v49.53,36.04 | 61.76,41.64 62.56,42.44 R9.2 | 61.76,41.64 v61.49,41.38 | 74.64,31.36 76.66,33.38 77.65,33.38 IC3.8 77.72,33.45 79.52,35.24 | 74.64,31.36 74.6,31.32 74.6,28.96 74.98,28.57 75.44,28.57 75.82,28.96 75.82,29.49 76.5,30.18 78.87,30.18 79.02,30.02 79.02,29.95 81,27.96 82.07,27.96 83.44,26.59 83.44,25.15 82.91,24.61 82.91,23.32 R35.2 | 79.52,35.24 80.24,35.97 80.24,37.34 81.99,39.09 82.83,39.09 IC4.4 82.91,39.09 84.12,37.87 v84.43,37.87 | 61.76,41.64 65.23,38.18 67.82,38.18 74.64,31.36 | v64.08,43.28 64.31,43.51 64.31,43.81 IC2.8
+5V  (via drill 0.35)
  Top 0.152: v9.68,22.17 9.68,23.62 10.21,24.16 v10.29,24.16 v9.45,24.99 v7.24,27.2 | v21.26,25.07 20.73,24.54 v20.12,24.54 | v19.13,29.79 v20.12,30.79 | v42.9,13.72 38.63,9.45 38.63,9.37 38.1,8.84 38.1,7.7 DUE1.5V 38.1,7.62 38.1,6.55 v39.55,5.11
  Bottom 0.152: 20.12,32.31 18.06,32.31 L2.1 | 20.12,32.31 20.57,32.31 C20.1 20.12,32.31 | C21.1 27.2,24.69 24,24.69 22.78,25.91 22.78,26.06 U5.11 22.78,25.83 22.63,25.83 21.87,25.07 v21.26,25.07 | R25.1 8.61,22.17 v9.68,22.17 10.44,22.17 11.35,21.26 C33.1 11.43,21.18 11.73,21.18 12.42,20.5 21.64,20.5 22.25,21.11 22.71,21.11 34.44,9.37 34.44,6.55 35.89,5.11 v39.55,5.11 39.85,4.8 72.92,4.8 74.6,6.48 74.6,8.31 78.33,12.04 78.33,15.39 76.89,16.84 76.89,18.44 J2.1 | v9.45,24.99 9.83,24.99 10.74,25.91 10.74,26.06 U6.11 | v10.29,24.16 10.74,24.16 11.35,23.55 C32.1 11.35,23.62 15.16,27.43 16.46,27.43 16.65,27.62 | 16.65,27.62 16.84,27.81 16.84,28.42 17.98,29.57 17.98,29.79 R15.1 18.06,29.79 v19.13,29.79 | v20.12,24.54 19.74,24.54 16.65,27.62 | v7.24,27.2 7.24,29.49 6.02,30.71 6.02,32 L9.1 | v20.12,30.79 20.12,32.31 | C7.1 35.66,43.97 35.66,43.74 37.49,41.91 U4.1 38.79,40.62 38.86,40.62 41.76,37.72 41.76,15.32 42.9,14.17 v42.9,13.72
ACCELINT1
  Bottom 0.152: U2.P$11 89.23,75.59 89.23,75.89 88.95,76.4 88.95,77.23 86.55,77.23 86.55,76.6 57.38,76.58 36.8,56.01 DUE1.10
ACCELINT2
  Bottom 0.152: U2.P$9 88.24,75.59 88.24,75.82 87.78,76.28 57.99,76.28 40.31,58.6 40.31,54.79 39.7,54.18 33.83,54.18 32.69,55.32 32.69,57.15 32.16,57.68 30.86,57.68 29.18,56.01 DUE1.13
ACCELINT3  (via drill 0.35)
  Top 0.152: v88.32,53.8 v85.65,51.13
  Bottom 0.152: v85.65,51.13 85.65,50.37 IC$1.7 | v88.32,53.8 88.32,55.32 88.24,55.4 88.24,60.96 95.71,68.43 95.71,78.18 95.33,78.56 58.83,78.56 38.25,57.99 23.55,57.99 21.57,56.01 DUE1.SDA1
ACCELSA0
  Bottom 0.152: U2.P$7 87.94,74.22 86.87,74.22 75.59,62.94 75.59,58.37 75.21,57.99 71.63,57.99 71.32,58.29 64.92,58.29 64.31,58.9 50.6,58.9 50.29,59.21 49.84,59.21 48.23,57.61 48.23,56.01 DUE1.6
ACCELSA1  (via drill 0.35)
  Top 0.152: v51.13,49.99 45.72,55.4 45.72,55.93 DUE1.7
  Bottom 0.152: v51.13,49.99 67.51,49.99 72.54,44.96 79.25,44.96 79.55,45.26 79.55,46.41 83.13,49.99 84.43,49.99 IC$1.5
AMP2A  (via drill 0.35)
  Top 0.152: v54.63,24.84 54.63,24.08 50.6,20.04 47.62,20.04 46.1,18.52 45.8,18.52 J1.3
  Bottom 0.152: v54.63,24.84 56.92,27.13 58.37,27.13 IC$3.3 | DUE1.A6 65.91,7.7 65.61,7.7 55.93,17.37 46.86,17.37 45.8,18.44 J1.3
AMP2B
  Bottom 0.152: 56.73,18.55 56.69,18.52 50.83,18.52 J1.1 | 56.73,18.55 58.75,20.57 60.35,20.57 61.87,22.1 61.87,27.13 63.09,28.35 63.55,28.35 IC$3.5 | DUE1.A7 68.5,7.7 68.12,7.7 65.38,10.44 64.47,10.44 56.77,18.14 56.77,18.52 56.73,18.55
DREF1  (via drill 0.35)
  Top 0.152: v45.95,45.19 45.95,44.5 43.97,42.52 43.97,28.5 44.42,28.04 J8.3 | v43.51,16.46 42.6,17.37 42.29,17.37 41.68,17.98 41.68,19.05 v42.37,19.74
  Bottom 0.152: v45.95,45.19 45.95,43.97 U3.2 | v43.51,16.46 44.12,16.46 52.88,7.7 53.26,7.7 DUE1.A1 | v42.37,19.74 42.37,25.91 44.42,27.96 J8.3
DREF2  (via drill 0.35)
  Top 0.152: v47.93,45.19 50.2,43.1 50.7,43.1 51.3,42.5 51.3,38.9 50.14,37.74 50.14,37.64 50.14,28.65 J9.3 50.83,27.96 50.98,27.81 52.5,27.81 55.24,25.07 55.24,19.96 55.7,19.51 v55.7,16.76
  Bottom 0.152: v47.93,45.19 47.93,43.97 U3.5 | v55.7,16.76 55.78,16.69 55.78,7.7 DUE1.A2
GND  (via drill 0.35)
  Bottom 0.152: v88.35,76.55 88.44,76.51 88.49,76.3 88.5,76.29 88.5,76.27 88.75,75.97 U2.P$10 | U3.8 49.68,38.08 49.68,38.31 49.78,38.42 49.78,40.38 v50.3,40.9 | IC6.3 70.45,23.05 71,23.6 71,27 C42.1 | v89.55,76.65 89.4,76.55 89.75,76.2 U2.P$12
  other vias: 29,47.7 79.7,73.9 98.1,74.2 86.5,69.2 83.4,77.4 91.2,77.4 91.7,75.4 92.45,73.85 80.85,65.35 36.2,60.85 44.05,58.7 36.5,53.2 33.7,47.5 92.5,71.4 3.45,46.1 8.3,44.7 23.25,41.65 26,43.6 26.55,41.2 20,38.5 24.3,38.7 28,34.7 28.3,30.85 25.9,28.1 26,25.5 20.45,36.55 8.9,33.8 8.6,38.2 3.8,30 3.6,26.1 13.9,27.2 14.6,22.9 14.5,21.1 36.1,47.5 39.8,38.5 41.8,40.8 46.2,46.7 48.4,47.1 51.2,45.2 46.9,36.2 52.1,41 53.2,39.6 54.4,38.1 58.2,42.6 70,45.4 70,41 73.9,38.1 61.3,36.6 70.9,48.5 73.5,52.3 80.9,51.3 77.2,45.7 82.8,37.1 87.7,36.9 85.1,42.9 88.4,41.2 89.85,41.4 86.9,47.7 89.5,46.6 83.7,48.2 86.6,51.1 66.6,36.2 68.9,36.3 66.8,32.7 67.5,28.6 69.8,28.6 66.4,21.3 69.3,21.3 78.6,21.5 77.9,23.1 76.7,28.3 83.5,19.8 79.5,19.7 61,27.9 55.3,28.6 56.3,22 85.75,29.7 88.6,31.5 89.45,20 86,20.05 88.55,22.9 25.2,13.3 46.45,11.5 52.5,14 58.2,11.5 64.3,16.35 71.65,5.85 78,4.65 86.2,13.9 64.8,9.65 67.3,9.95 72.3,11.65
  pour Top: -0.5,100.75 120.5,100.75 120.5,0.25 -0.5,0.25
  pour Bottom: -0.5,100.75 120.5,100.75 120.5,0.25 -0.5,0.25
  pour Top: -0.5,100.75 120.5,100.75 120.5,0.25 -0.5,0.25
GPSGND
  Bottom 0.152: C3.2 35.75,76.25 34.6,77.4 U1.1 32,77.5 32,78.7 31.6,79.1 20.3,79.1 18.8,77.6 18.8,72 20,70.8 U1.12 23.8,70.8 23.8,68.6 U1.10
  Bottom 0.406: 17.4,65.4 20.6,68.6 U1.10
  Bottom 0.508: 6.8,67.9 9.3,65.4 C1.2 C2.2 17.4,65.4
  Bottom 1.016: J5.1 1.74,73.04 1.7,73 1.7,67.9 5,67.9 | 6.8,67.9 5,67.9 | 5,67.9 2.8,65.7 2.8,64.03 L8.2
GPSPPS  (via drill 0.35)
  Top 0.152: v34.5,72.3 34.5,71.3 34.8,71 40.1,71 48.2,62.9 53.5,62.9 58.4,58 58.4,55.99 DUE1.2
  Bottom 0.152: U1.4 33.7,74.1 34.5,73.3 v34.5,72.3
GPSRX  (via drill 0.35)
  Top 0.152: v34.6,74.3 37.2,71.7 40.5,71.7 48.5,63.7 73.2,63.7 78.7,58.2 78.7,55.97 DUE1.TX1
  Bottom 0.152: U1.3 33.7,75.2 v34.6,74.3
GPSTX  (via drill 0.35)
  Top 0.152: v34.6,75.6 37.8,72.4 40.8,72.4 48.9,64.3 75,64.3 81.2,58.1 DUE1.RX1
  Bottom 0.152: U1.2 33.9,76.3 v34.6,75.6
LED1
  Bottom 0.152: R16.1 5.03,52.65 6.1,52.65 7.01,53.57 29.26,53.57 31.62,55.93 DUE1.12
LED2  (via drill 0.35)
  Top 0.152: v32.92,54.18 34.21,55.47 DUE1.11
  Bottom 0.152: v32.92,54.18 32,53.26 19.66,53.26 19.05,52.65 7.54,52.65 R17.1
LEDB  (via drill 0.35)
  Top 0.152: v71.02,8.69 72.01,7.7 73.53,7.7 DUE1.A8 | v57.38,18.36 55.85,19.89 v55.85,20.19
  Bottom 0.152: v71.02,8.69 69.72,8.69 67.67,10.74 64.92,10.74 57.38,18.29 v57.38,18.36 | v55.85,20.19 44.88,20.19 43.2,18.52 J1.4
MAX1932!CL  (via drill 0.35)
  Top 0.152: v19.2,28.88 v14.4,33.68 14.48,33.68 15.16,34.37 v15.16,34.67 | v52.73,59.51 55.78,56.46 55.78,56.01 DUE1.3 | v33.83,52.43 v34.67,51.59 | v18.14,50.06 v18.14,51.28
  Bottom 0.152: v14.4,33.68 13.64,33.68 13.11,33.15 10.74,33.15 9.22,31.62 9.22,29.95 8.91,29.64 8.91,28.88 U6.3 | v19.2,28.88 20.88,28.88 U5.3 | v52.73,59.51 47.02,59.51 42.82,55.32 42.82,54.71 39.7,51.59 v34.67,51.59 | v33.83,52.43 19.28,52.43 v18.14,51.28 | v18.14,50.06 18.14,46.25 15.16,43.28 v15.16,34.67
MAX1932!CS1  (via drill 0.35)
  Top 0.152: v82.91,58.14 84.51,58.14 v84.73,58.37 | v22.48,20.5 22.48,21.34 19.43,24.38 v19.43,25.68
  Bottom 0.152: 20.19,26.44 18.52,28.12 18.06,28.12 R15.2 | 20.19,26.44 20.95,25.68 21.49,25.68 21.87,26.06 U5.12 | v82.91,58.14 81.23,58.14 80.16,57.07 80.16,55.24 79.1,54.18 70.64,54.18 68.89,55.93 68.58,55.93 DUE1.TX3 | v84.73,58.37 86.03,58.37 87.71,56.69 87.71,52.73 91.06,49.38 91.06,17.14 82.22,8.31 82.22,6.48 79.02,3.28 58.37,3.28 57.76,3.89 56.46,3.89 55.55,2.97 35.51,2.97 31.39,7.09 31.39,10.74 22.48,19.66 v22.48,20.5 | 20.19,26.44 v19.43,25.68
MAX1932!CS2  (via drill 0.35)
  Top 0.152: v7.32,23.77 7.73,24.19 | 7.73,24.19 v8.53,24.99 | v68.58,58.9 71.02,56.46 71.02,56.01 DUE1.RX3 | v19.51,51.82 19.43,51.89 17.91,51.89 3.66,37.64 3.3,37.3 2.8,36.8 2.8,29.5 3.66,28.64 3.66,28.27 7.73,24.19
  Bottom 0.152: v8.53,24.99 8.61,24.99 9.68,26.06 9.91,26.06 U6.12 | v7.32,23.77 7.32,22.63 6.93,22.25 R25.2 | v68.58,58.9 64.77,58.9 63.55,60.12 43.81,60.12 40.62,56.92 40.62,54.63 38.18,52.2 34.44,52.2 34.06,51.82 v19.51,51.82
MAX1932DIN  (via drill 0.35)
  Top 0.152: v24.31,26.44 22.78,27.96 v19.89,27.96 10.44,27.96 8.46,29.95 v8.46,30.02 6.93,28.5 v4.27,28.5 | v44.04,64.62 v50.06,58.6
  Bottom 0.152: v19.89,27.96 20.88,27.96 U5.2 | v24.31,26.44 25.3,26.44 27.2,28.35 R14.2 | v8.46,30.02 8.15,29.72 8.15,28.5 8.61,28.04 8.84,28.04 U6.2 | R27.2 5.18,27.58 v4.27,28.5 2.82,29.95 2.82,42.06 2.21,42.67 2.21,57.91 3.12,58.83 6.02,58.83 6.63,59.44 8.61,59.44 8.84,59.21 38.63,59.21 v44.04,64.62 | v50.06,58.6 64.16,58.6 64.77,57.99 71.17,57.99 73.15,56.01 73.53,56.01 DUE1.TX2
MAX1932SCLK  (via drill 0.35)
  Top 0.152: v9.22,26.44 11.2,26.44 v13.11,24.54 13.03,24.54 10.29,21.79 v10.29,21.49 v8.23,19.43 | v20.34,25.45 v21.18,26.29 | v74.98,58.6 75.89,57.68 75.89,57.61 76.12,57.38 76.12,56.01 DUE1.RX2 | v41,62.41 v42.98,60.43
  Bottom 0.152: v9.22,26.44 8.91,26.75 8.91,27.13 U6.1 | v13.11,24.54 14.4,24.54 15.39,23.55 20.88,23.55 R13.2 20.88,23.62 20.88,24.61 20.34,25.15 v20.34,25.45 | v21.18,26.29 20.95,26.52 20.95,27.13 U5.1 | v10.29,21.49 10.21,21.41 6.33,21.41 6.1,21.64 6.1,24.69 5.26,25.53 5.26,25.83 R26.2 | v74.98,58.6 69.72,58.6 67.89,60.43 v42.98,60.43 | v41,62.41 34.14,62.41 31.62,59.89 14.42,59.89 13.12,61.19 2.97,61.19 1.6,59.82 1.6,25.22 7.39,19.43 v8.23,19.43
N$2  (via drill 0.35)
  Top 0.152: v56.31,25.22 v55.24,26.29
  Bottom 0.152: v55.24,26.29 55.24,27.05 57.15,28.96 63.17,28.96 63.86,29.64 63.86,30.71 R7.1 | v56.31,25.22 57.76,25.22 58.37,24.61 IC$3.1
N$4
  Bottom 0.152: R8.1 63.93,32.69 63.93,32.16 64.77,31.32 64.77,29.03 65,28.8 65,26.75 64.16,25.91 63.63,25.91 IC$3.7
N$5
  Bottom 0.152: C17.2 66.37,47.93 64.16,47.93 IC2.5
N$6
  Bottom 0.152: 66.37,45.49 64.24,45.49 64.16,45.41 IC2.7 64.16,45.49 64.16,46.63 IC2.6 | 66.37,45.49 68.05,43.81 R10.1 | 66.37,45.49 C19.2
N$7
  Bottom 0.152: C36.2 81.08,21.26 81.08,21.95 77.88,25.15 77.88,29.41 77.72,29.57 IC3.5
N$8  (via drill 0.35)
  Top 0.152: v8.15,34.52 v7.16,33.53
  Bottom 0.152: v7.16,33.53 7.54,33.53 8,33.07 8,31.01 7.85,30.86 7.85,24.84 8.31,24.38 9.68,24.38 10.06,24.77 10.44,24.77 11.51,25.83 11.51,26.06 U6.10 | v8.15,34.52 8.84,34.52 9.45,35.13 10.97,35.13 11.89,34.21 Q2.1
N$9
  Bottom 0.152: 6.25,36.35 6.25,36.2 6.02,35.97 L9.2 6.25,36.35 | 6.25,36.35 BAT46WH2.2 | 6.25,36.35 10.97,36.35 Q2.3
N$10  (via drill 0.35)
  Top 0.152: v8.91,32.31 v9.91,31.32
  Bottom 0.152: v9.91,31.32 9.91,29.87 U6.4 | v8.91,32.31 8.91,32.77 7.16,34.52 4.12,34.52 3.81,34.82 3.81,38.41 6.25,40.84 BAT46WH2.1 6.25,40.92 6.25,41.6 | 6.25,41.6 6.25,42.82 R28.2 | 6.25,41.6 10.82,41.6 11.66,42.44 11.81,42.44 C29.1
N$11
  Bottom 0.152: U6.6 11.58,29.87 11.58,30.18 13.95,32.54 R29.1
N$12
  Bottom 0.152: U6.8 12.65,28.04 15.62,28.04 15.93,28.35 R32.1
N$13
  Bottom 0.152: C30.1 16,24.38 16,26.59 R32.2
N$14
  Bottom 0.152: U6.7 12.65,28.88 12.65,29.57 13.95,30.86 R29.2 14.02,30.94 14.02,31.24 15.01,32.23 15.01,33.98 11.89,37.11 11.89,38.18 R31.2 11.81,38.25 10.21,39.85 10.21,40.46 R30.1
N$17
  Bottom 0.152: IC3.7 77.65,32.08 77.65,30.94 IC3.6 77.72,30.86 78.64,30.86 80.54,28.96 80.54,28.88 81.15,28.27 82.22,28.27 84.66,25.83 84.66,23.39 85.11,22.94 87.71,22.94 87.74,22.9 | 87.74,22.9 88.62,23.77 88.62,26.29 89.31,26.98 R36.1 | 87.74,22.9 87.71,22.86 87.71,21.57 C37.2
N$18  (via drill 0.35)
  Top 0.152: v63.02,38.48 v64.24,37.26
  Bottom 0.152: v64.24,37.26 67.51,33.98 68.45,33.98 69.57,32.77 70.48,32.77 IC1.4 | v63.02,38.48 63.02,39.01 60.88,41.15 60.88,42.44 R9.1 60.88,42.52 60.88,43.89 59.44,45.34 58.9,45.34 IC2.2
N$19
  Bottom 0.152: U5.10 23.62,26.06 23.85,26.06 24.08,25.83 25.3,25.83 27.13,27.66 27.89,27.66 28.88,28.65 28.88,39.93 28.35,40.46 27.13,40.46 25.98,39.32 25.98,38.94 25.3,38.25 25.1,38.1 24.45,38.1 24.45,37.7 24,37.4 23.4,37.4 23.25,37.25 23.24,36.88 23.24,35.2 Q1.1
N$21
  Bottom 0.152: C39.2 79.32,36.8 79.32,37.49 77.72,39.09 IC4.5
N$22
  Bottom 0.152: 86.79,42.22 86.79,42.82 R40.1 | 86.79,42.22 86.79,40.92 C40.2 | 86.79,42.22 78.26,42.22 77.72,41.68 IC4.7 77.65,41.6 77.65,40.39 IC4.6
N$24  (via drill 0.35)
  Top 0.152: v73.23,24.23 73.23,27.2 v75.21,29.18
  Bottom 0.152: v73.23,24.23 71.09,22.1 69.34,22.1 68.43,23.01 67.51,23.01 IC6.4 | v75.21,29.18 75.21,31.47 76.58,32.84 85.5,32.84 86.56,33.91 R39.1 86.56,33.98 85.04,35.51 85.04,39.93 83.36,41.6 82.91,41.6 IC4.2
N$25  (via drill 0.35)
  Top 0.152: v80.09,28.04 v81.15,29.11
  Bottom 0.152: IC5.4 74.22,23.01 75.13,23.01 77.65,20.5 80.15,20.5 80.25,20.4 81.75,20.4 81.99,20.44 81.99,20.45 81.99,20.5 81.99,22.4 R35.1 81.08,23.32 79.93,24.46 79.93,26.44 80.09,26.59 v80.09,28.04 | v81.15,29.11 81.15,31.39 81.84,32.08 82.83,32.08 IC3.2
N$30
  Bottom 0.152: U4.2 39.47,41.91 41.07,43.51 41.07,43.97 C11.1 41.15,43.97 45.26,43.97 U3.1 45.26,44.04 45.26,45.44 45.3,46.8 45.32,46.82 45.82,47.4 46.8,47.4 47.23,46.97 47.23,46.95 47.24,44.73 47.24,43.97 U3.4
N$31
  Bottom 0.152: 18.21,37.34 18.21,36.42 18.06,36.27 L2.2 | 18.21,37.34 18.21,38.56 BAT46WH1.2 | 18.21,37.34 22.17,37.34 Q1.3
N$32
  Bottom 0.152: U5.4 21.87,29.87 20.04,29.87 18.9,31.01 16.15,31.01 15.85,31.32 15.85,39.01 17.35,41.35 17.38,41.38 18.21,41.38 BAT46WH1.1 | R20.2 18.29,43.13 18.29,41.45 BAT46WH1.1 | C23.1 21.39,40.13 19.94,40.13 19.65,40.4 19.5,40.55 19.5,41.1 19.15,41.45 18.36,41.45 BAT46WH1.1
N$47
  Bottom 0.152: U5.7 24.69,28.88 24.69,31.85 25.22,32.38 R19.2 25.3,32.46 26.02,33.19 | 26.02,33.19 26.06,33.22 26.06,34.67 25.3,35.43 25.3,35.59 R21.1 | 26.02,33.19 26.36,32.84 28.42,32.84 28.57,32.99 28.57,36.27 27.81,37.03 27.81,37.34 R22.2
N$53
  Bottom 0.406: R1.1 14.15,68.25 14.1,68.2 13.8,68.2 13.5,67.9 C1.1 | 12.2,69.8 14.1,69.8 | L1.1 14.19,69.79
  Bottom 0.508: 14.1,69.8 R1.1 14.19,69.79
  Bottom 1.016: J5.5 11.5,70.5 12.2,69.8
N$54
  Bottom 0.152: U5.6 23.62,29.87 23.62,31.39 24.46,32.23 24.46,33.3 25.22,34.06 R19.1
N$55
  Bottom 0.152: U5.8 24.69,28.04 24.84,28.04 26.44,29.64 26.44,30.71 27.58,31.85 27.74,31.85 R18.1
N$56
  Bottom 0.152: R18.2 26.89,33.6 26.89,34.11 26.9,34.95 26.9,38.79 27.74,39.62 C22.1
N$63
  Bottom 0.152: U2.P$3 89.31,72.92 89.31,70.56 90.83,69.04 C9.1
N$64
  Bottom 0.152: U2.P$2 89.76,72.92 89.76,71.86 92.58,69.04 C9.2
N$65
  Bottom 0.152: U2.P$15 90.6,74.3 91.44,74.3 94.56,77.42 C8.1
N$66
  Bottom 0.508: L1.2 R2.2
N$67
  Bottom 0.508: R2.1 20.55,73.25 20.8,73 U1.14
N$68
  Bottom 0.406: C2.1 16.5,68 16.3,68.2 15.9,68.2 15.9,69.58 | 15.9,69.58 15.9,69.7 R1.2 | U1.11 19.4,69.7 | 17.5,69.7 16.02,69.7 15.9,69.58
  Bottom 1.016: 19.4,69.7 17.5,69.7
N$72
  Bottom 0.152: R16.2 4.95,54.41 4.95,55.78 3.28,57.45 D1.1
N$73
  Bottom 0.152: R17.2 7.47,54.41 7.47,55.78 5.79,57.45 D1.3
PA0  (via drill 0.35)
  Top 0.152: v65.38,29.57 v57.15,37.8
  Bottom 0.152: v57.15,37.8 54.79,35.43 49.3,35.43 47.32,37.41 47.32,38.02 U3.11 | v65.38,29.57 65.38,28.27 66.67,26.98 66.67,22.63 68.73,20.57 76.73,20.57 78.64,18.67 78.64,10.74 76.2,8.31 76.2,7.7 DUE1.A9
PA1
  Bottom 0.152: U3.10 47.93,38.02 47.93,37.49 48.62,36.8 49.68,36.8 49.7,36.8 52.25,39.35 52.25,39.95 52.9,40.6 53.55,40.6 57.53,44.65 57.53,45.72 57.76,45.95 60.5,45.95 63.17,43.28 63.25,43.28 63.55,42.98 63.55,40.39 65.23,38.71 70.64,38.71 76.28,44.35 84.73,44.35 85.72,45.34 87.4,45.34 90.45,42.29 90.45,19.43 78.72,7.7 DUE1.A10
PA2  (via drill 0.35)
  Top 0.152: v78.18,47.62 78.64,47.62 v81.31,44.96
  Bottom 0.152: v78.18,47.62 78.18,47.7 76.73,49.15 72.69,49.15 64.16,57.68 50.29,57.68 49.68,57.07 49.68,54.79 49.99,54.48 50.1,42.5 50.6,42 50.9,42 50.9,39.1 49.99,38.19 49.99,37.57 49.53,37.11 48.92,37.11 48.62,37.41 48.62,38.02 U3.9 | v81.31,44.96 84.89,44.96 85.57,45.64 87.55,45.64 90.75,42.44 90.75,17.3 81.15,7.7 DUE1.A11
PSUF1  (via drill 0.35)
  Top 0.152: v61.8,21.18 v60.96,22.02 | v39.7,12.72 v39.7,14.1 v42.37,16.76
  Bottom 0.152: IC$3.8 63.55,24.54 62.94,23.93 62.94,22.02 C14.2 62.87,21.95 62.1,21.18 v61.8,21.18 | v60.96,22.02 59.66,22.02 C13.1 59.66,21.95 57.3,19.58 45.26,19.58 44.27,18.59 44.27,18.06 42.98,16.76 v42.37,16.76 | v39.7,14.1 39.93,14.33 39.93,18.67 36.27,22.33 36.27,35.13 C25.1 | v39.7,12.72 40.46,12.72 40.92,12.27 L4.1
PSUF2  (via drill 0.35)
  Top 0.152: v42.37,33.91 42.22,33.76 v41.15,33.76
  Bottom 0.152: C42.2 67.89,26.98 67.51,26.59 67.51,24.99 IC6.5 67.51,24.92 67.51,24.38 69.49,22.4 70.56,22.4 73.08,24.92 74.14,24.92 IC5.5 74.14,24.84 74.14,24.46 76.2,22.4 76.5,22.15 76.95,21.7 76.94,21.7 77.5,21.7 78.67,22.63 78.67,23.87 77.55,24.9 77.52,25.43 76.96,25.98 75.44,25.98 74.68,26.75 C41.2 74.6,26.82 70.56,30.86 | 70.56,30.86 70.56,31.55 71.32,32.31 71.32,33.3 69.88,34.75 C16.2 69.8,34.82 69.49,34.82 66.45,37.87 58.06,37.87 54.1,33.91 v42.37,33.91 | 70.56,30.86 IC1.5 | 40.39,33.76 40.39,15.09 40.92,14.55 L5.1 | 40.39,33.76 40.39,34.75 C26.1 | 40.39,33.76 v41.15,33.76
PSUF3  (via drill 0.35)
  Top 0.152: v12.6,60.2 23.6,60.2 29.6,66.2 v31.7,66.2 | v31.7,66.2 31.8,66.2 v31.7,66.2
  Bottom 0.152: C27.1 8,60.27 10.36,60.27 10.44,60.2 L6.1 12.57,60.17 v12.6,60.2 | U1.9 32.1,66.6 v31.7,66.2 | U1.6 32.8,71.9 34,70.7 34,69.71 | 34,69.71 34,68.7 33.9,68.6 | U1.8 33.99,69.7 34,69.71
  Bottom 0.508: C3.1 34.75,65.15 34.2,65.7 34.2,68.3 33.9,68.6 U1.9
REFA
  Bottom 0.152: IC$3.2 58.37,25.83 56.08,25.83 55.24,24.99 55.24,24.61 54.86,24.23 45.72,24.23 44.5,25.45 J8.2
REFB  (via drill 0.35)
  Top 0.152: v63.09,29.72 v65.61,27.2
  Bottom 0.152: v65.61,27.2 65.61,26.06 64.85,25.3 62.41,25.3 62.26,25.45 62.26,26.29 63.09,27.13 63.55,27.13 IC$3.6 | v63.09,29.72 55.02,29.72 50.83,25.53 J9.2
SCL0  (via drill 0.35)
  Top 0.152: v44.58,38.1 v45.87,36.8
  Bottom 0.152: 85,48.2 82.75,45.95 R4.2 | 85,48.2 85.04,48.23 85.04,48.46 IC$1.2 | U2.P$4 88.7,72.92 88.7,63.17 84.12,58.6 84.12,58.14 86.26,56.01 DUE1.SCL 86.26,55.93 86.26,54.79 84.77,53.3 | 84.77,53.3 79.06,47.59 | 79.06,47.59 78.03,46.56 76.05,46.56 IC$2.P$6 | v45.87,36.8 45.87,38.02 U3.13 | v44.58,38.1 44.58,42.67 44.88,42.98 49.53,42.98 49.68,43.13 49.68,54.33 49.38,54.63 49.38,57.23 50.14,57.99 64.31,57.99 72.85,49.45 77.19,49.45 79.06,47.59 | 84.77,53.3 85.6,54.1 87.7,52 87.7,49.24 86.18,47.93 85.42,47.93 85.19,48.16 85.04,48.16 85,48.2
SDA0  (via drill 0.35)
  Top 0.152: v74.91,44.35 v73.69,45.57 | v53.34,34.82 59.28,40.77 62.87,40.77 v64.16,42.06 | v83.59,49.38 83.29,49.68 83.29,53.95 83.52,54.18 83.52,54.25 83.74,54.48 DUE1.SDA
  Bottom 0.152: U2.P$6 87.94,73.69 87.94,73.46 83.82,69.34 83.82,56.01 DUE1.SDA | 83.78,49.19 80.54,45.95 R5.1 80.47,45.87 80.47,45.72 79.4,44.65 76.12,44.65 75.82,44.35 v74.91,44.35 73.46,42.9 65.53,42.9 64.69,42.06 v64.16,42.06 | 83.78,49.19 83.97,49.38 84.43,49.38 IC$1.4 | v73.69,45.57 72.77,46.48 IC$2.P$1 | v53.34,34.82 49.23,34.82 46.63,37.41 46.63,38.02 U3.12 | 83.78,49.19 v83.59,49.38
STRIGA
  Bottom 0.152: IC5.2 76.81,24 76.81,24.92 IC5.1 76.73,24.99 75.36,24.99 74.37,25.98 73.99,25.98 68.69,31.28 | 68.69,31.28 68.73,31.32 68.73,33.15 68.55,33.35 68.4,33.5 68.12,33.5 68.1,33.65 67,33.65 66.95,34 65.12,34 64.72,33.83 64.7,33.5 64.85,33.38 64.85,31.7 65.53,31.01 65.53,30.79 R7.2 | 68.69,31.28 68.28,30.86 67.97,30.86 IC1.1
STRIGAOUT  (via drill 0.35)
  Top 0.152: v65.84,4.19 63.48,6.55 63.48,7.62 DUE1.A5 | v85.34,23.55 v84.51,22.71
  Bottom 0.152: 86.37,24.57 85.57,25.38 R38.1 85.5,25.45 85.5,25.68 84.2,26.98 84.2,30.02 83.36,30.86 82.91,30.86 IC3.3 | 86.37,24.57 86.64,24.31 87.63,24.31 R37.2 | v65.84,4.19 74.83,4.19 77.34,6.71 77.34,8.99 84.51,16.15 v84.51,22.71 | 86.37,24.57 v85.34,23.55
STRIGB
  Bottom 0.152: IC6.2 70.03,24 70.03,24.92 IC6.1 70.03,24.99 70.03,25.15 68.73,26.44 68.73,28.8 67.21,30.33 67.21,31.77 | 67.21,31.77 66.52,31.77 65.61,32.69 R8.2 | 67.21,31.77 67.89,31.77 IC1.2
STRIGBOUT  (via drill 0.35)
  Top 0.152: v52.58,4.19 50.9,5.87 50.9,6.1 50.75,6.25 50.75,7.62 DUE1.A0
  Bottom 0.152: IC4.3 82.83,40.31 82.3,39.78 76.5,39.78 76.28,40.01 76.28,43.28 76.66,43.66 87.4,43.66 87.55,43.51 87.55,39.17 89.23,37.49 89.23,37.19 R42.1 89.31,37.11 89.31,35.36 R41.2 89.31,35.28 90.14,34.44 90.14,23.62 89.99,23.47 89.92,23.47 88.54,22.1 88.54,19.74 77.65,8.84 77.65,6.55 74.68,3.58 65.61,3.58 65,4.19 v52.58,4.19
TRIGOUT
  Bottom 0.152: IC2.3 58.83,46.71 58.67,46.86 56.31,46.86 R11.1 56.24,46.86 54.03,46.86 R12.2 53.95,46.86 53.42,46.86 50.52,49.76 50.52,50.22 50.67,50.37 50.67,55.93 DUE1.5
UCDAC0  (via drill 0.35)
  Top 0.152: v77.72,14.25 83.74,8.23 83.74,7.7 DUE1.DAC0 | v57.91,21.03 v58.98,19.96
  Bottom 0.152: v77.72,14.25 77.72,15.54 75.36,17.91 75.36,18.97 74.07,20.27 59.28,20.27 v58.98,19.96 | v57.91,21.03 46.41,21.03 44.5,22.94 J8.1
UCDAC1  (via drill 0.35)
  Top 0.152: v61.27,22.94 67.28,16.92 77.19,16.92 85.04,9.07 85.04,8.91 86.26,7.7 DUE1.DAC1
  Bottom 0.152: v61.27,22.94 50.83,22.94 J9.1
VBIAS1  (via drill 0.35)
  Top 0.152: v24,36.65 24,37.57 v23.47,38.1
  Bottom 0.152: 24.35,36.46 25.22,37.34 R21.2 | 24.35,36.46 24.31,36.42 24.31,34.52 24,34.21 24,32.38 22.78,31.17 22.78,29.87 U5.5 | 25.11,42.25 23.62,43.74 D2.3 23.55,43.81 23.55,44.27 20.65,47.17 R23.2 20.88,47.47 18.29,44.88 R20.1 | 25.11,42.25 25.22,42.14 25.22,41.38 C24.1 25.22,41.3 24.38,40.46 24.38,39.47 23.97,39.47 23.5,39 23.47,38.56 v23.47,38.1 | J2.3 71.7,18.44 71.75,12.4 71.5,12.15 71.5,11.35 71.7,11.15 71.7,8.38 69.11,5.79 49.84,5.79 42.22,13.41 31.77,13.41 29.34,15.85 29.34,41.3 28.35,42.29 25.15,42.29 25.11,42.25 | v24,36.65 24.16,36.5 24.31,36.5 24.35,36.46
VBIAS2  (via drill 0.35)
  Top 0.152: v14.48,35.51 v11.43,32.46
  Bottom 0.152: v11.43,32.46 10.82,31.85 10.82,29.87 U6.5 | v14.48,35.51 14.48,37.87 11.89,40.46 R30.2 11.89,40.54 11.89,40.84 12.88,41.83 12.88,43.74 11.89,44.73 C31.1 11.81,44.81 11.81,45.72 10.13,47.4 R33.2 10.13,47.47 7.77,47.47 7.62,47.32 D3.3 7.54,47.24 7.54,46.25 6.33,45.03 6.33,44.65 R28.1 6.25,44.58 3.28,41.6 3.28,31.62 4.19,30.71 5.41,30.71 6.17,29.95 6.17,25.91 8.15,23.93 8.91,23.93 10.21,22.63 13.26,22.63 13.87,22.07 14.78,22.07 15.15,21.7 22.71,21.72 31.55,12.88 32.61,12.88 36.58,8.91 36.58,6.78 37.57,5.79 39.85,5.79 40.39,5.26 69.34,5.26 72.24,8.15 72.24,8.69 73,9.45 73,19.05 72.24,19.81 71.25,19.81 69.95,18.52 69.27,18.52 J2.4
VBIASFB1  (via drill 0.35)
  Top 0.152: v55.32,3.58 58.29,6.55 58.29,7.62 DUE1.A3 | v30.02,16.15 v28.42,14.55
  Bottom 0.152: R23.1 22.63,47.55 24.84,47.55 R24.2 24.92,47.47 26.44,45.95 26.44,45.34 C28.1 26.52,45.26 30.02,41.76 v30.02,16.15 | v55.32,3.58 36.96,3.58 33.98,6.55 33.98,8.99 v28.42,14.55
VBIASFB2  (via drill 0.35)
  Top 0.152: v2.21,41.83 v3.05,42.67 | v57.53,3.28 60.88,6.63 60.88,7.62 DUE1.A4
  Bottom 0.152: C34.1 13.79,45.19 13.79,47.4 13.87,47.47 R34.2 13.79,47.47 11.89,47.47 R33.1 11.81,47.55 11.66,47.55 10.82,48.39 7.01,48.39 6.4,47.78 6.4,45.72 6.17,45.49 5.56,45.49 3.05,42.98 v3.05,42.67 | v2.21,41.83 2.21,25.07 7.24,20.04 13.41,20.04 30.79,2.67 56.92,2.67 v57.53,3.28
(copper drawn outside any net)
  shapes: Bottom area x5, Top area x3

### Text on the board
bPlace: Accel+Mag | GPS | HTU21D
tSilk: 03/09/17 | Main PCB Version 2.4 / www.ohwr.org/projects/cosmic-pi | Released under the CERN OHL V1.2